# EasyEDA schematic 1-Schematic_andromeda.json

## Sheets
1 uC: TITLE: Sheet_1; REV: 1.0; Date: 2021-03-31; Sheet: 1/1; Drawn By: Łukasz Wojnarowski; Company: Your Company
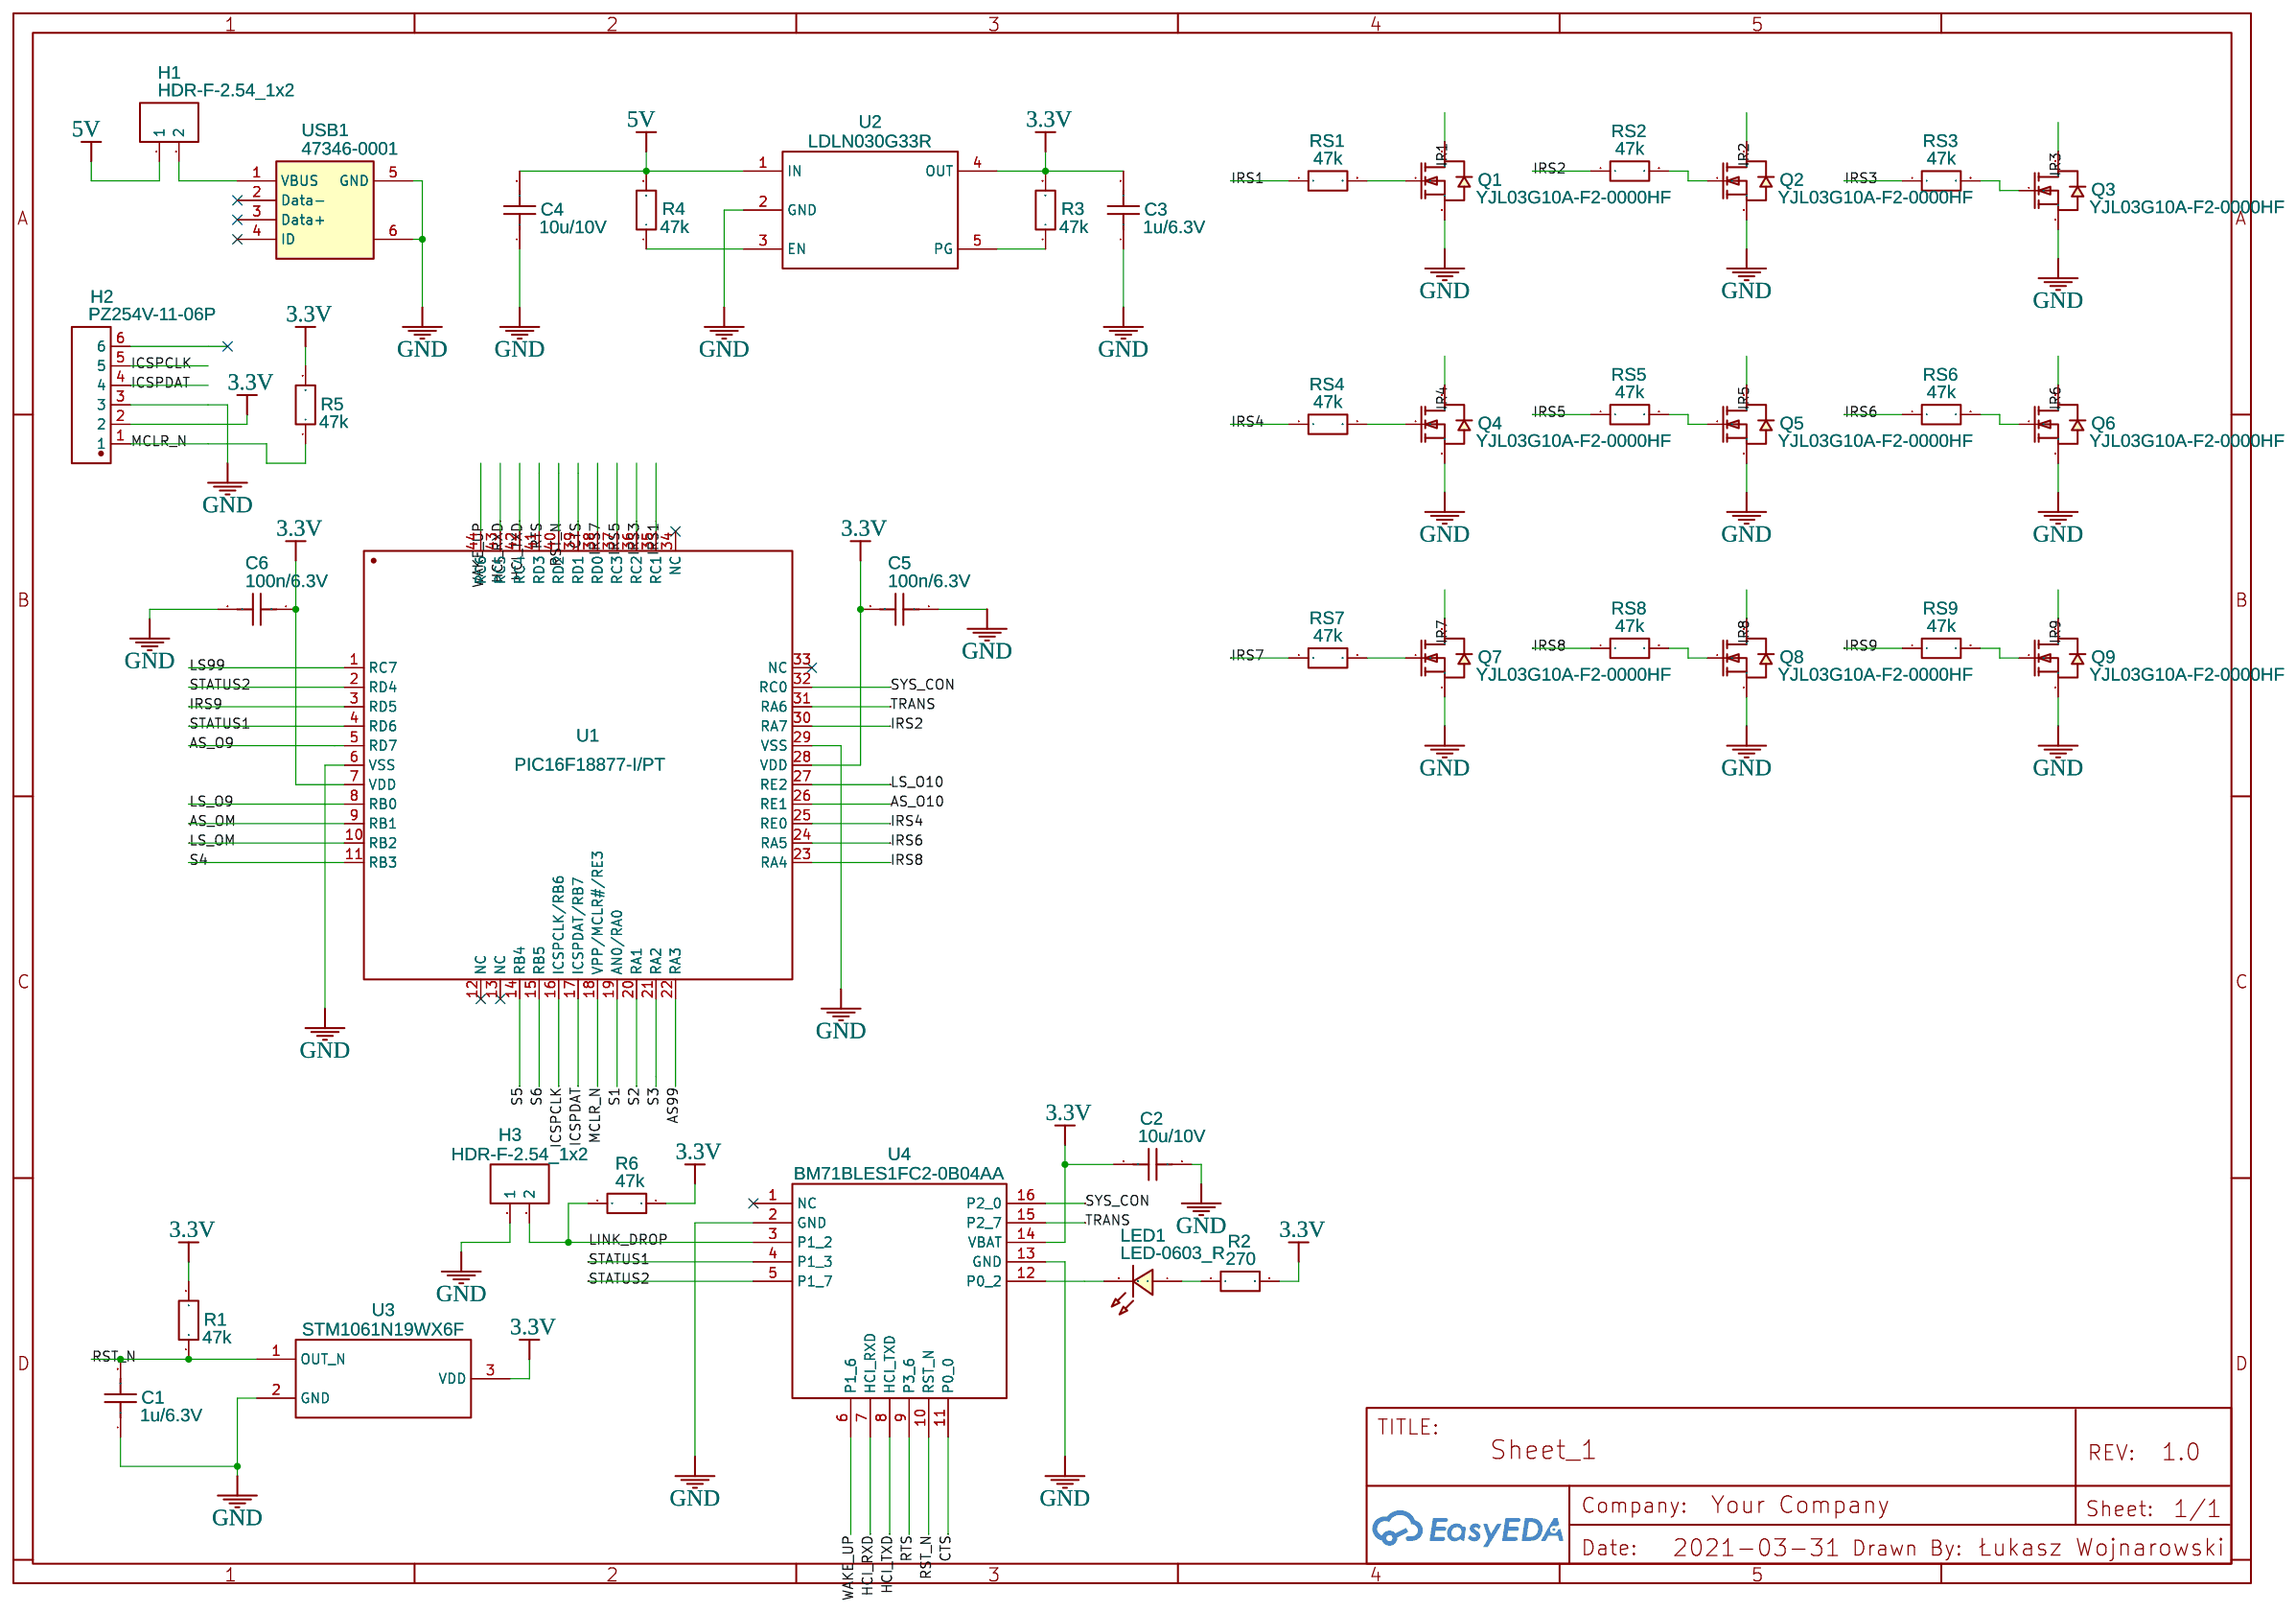
[diagram p0: uC]
2 MUX: TITLE: Sheet_2; Date: 2021-04-02; Drawn By: lukwojnar
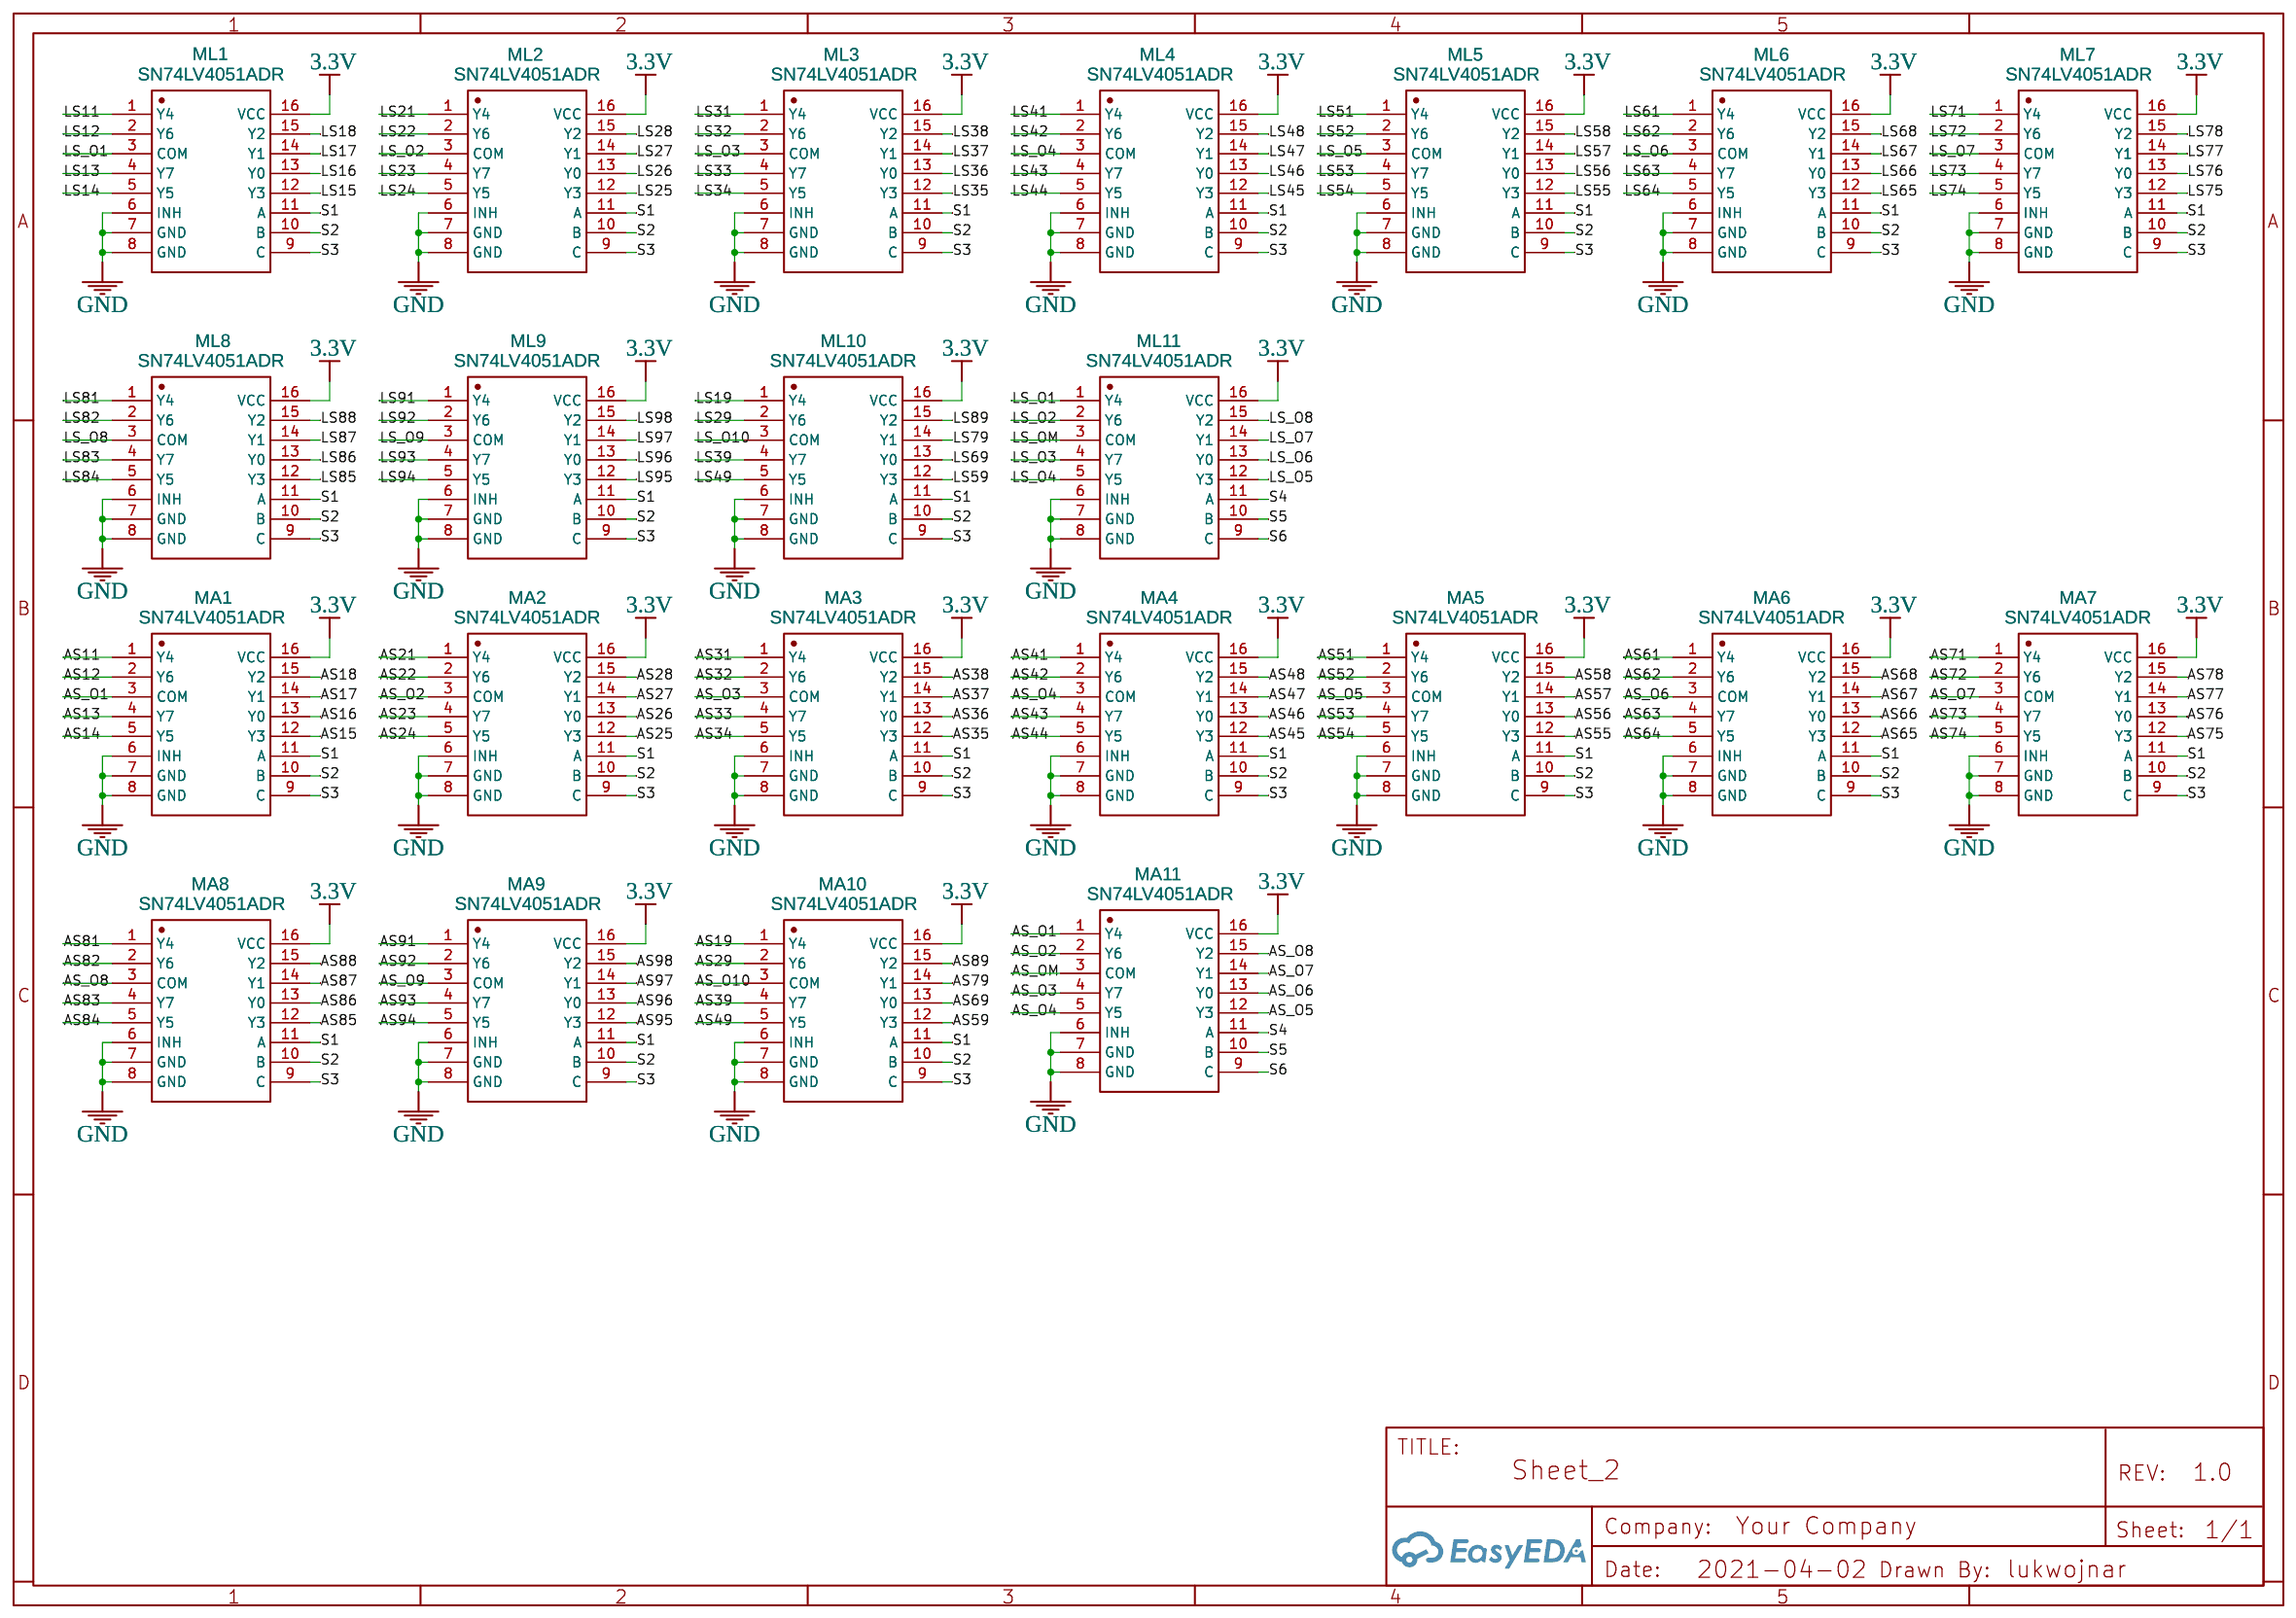
[diagram p1: MUX]
3 Light Sensors 1: Date: 2021-04-02
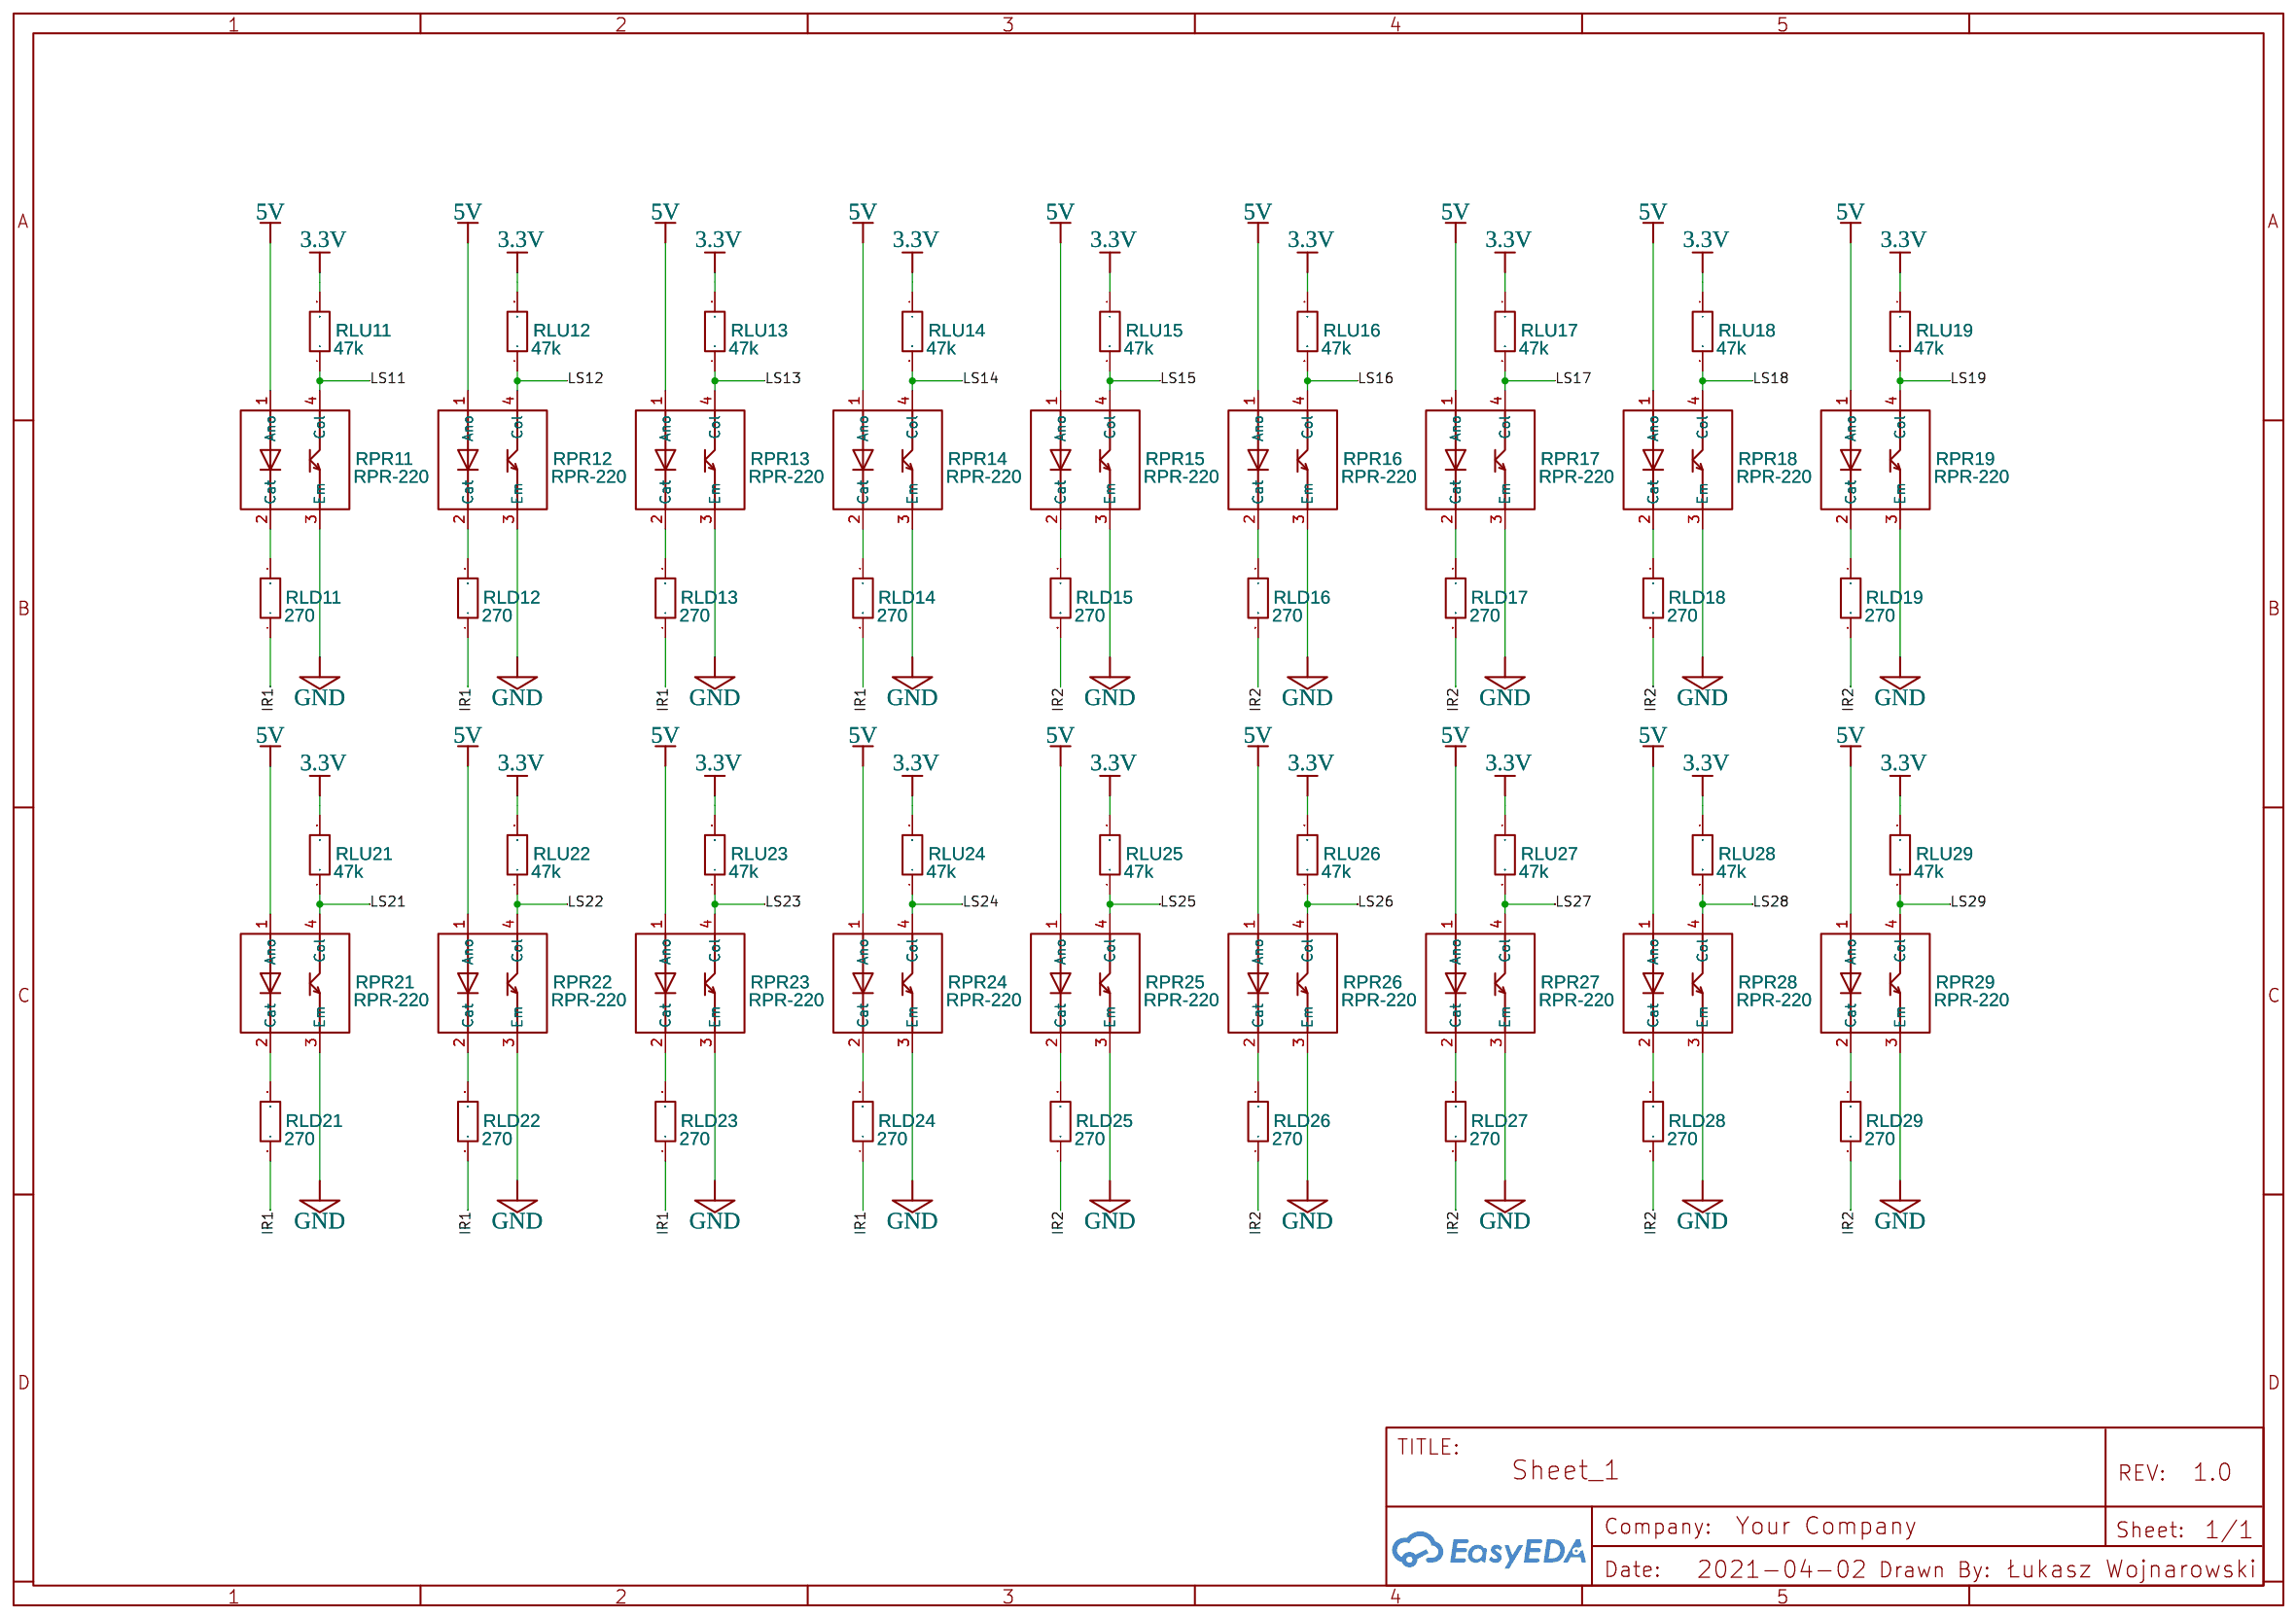
[diagram p2: Light Sensors 1]
4 Light Sensors 2: Date: 2021-04-03
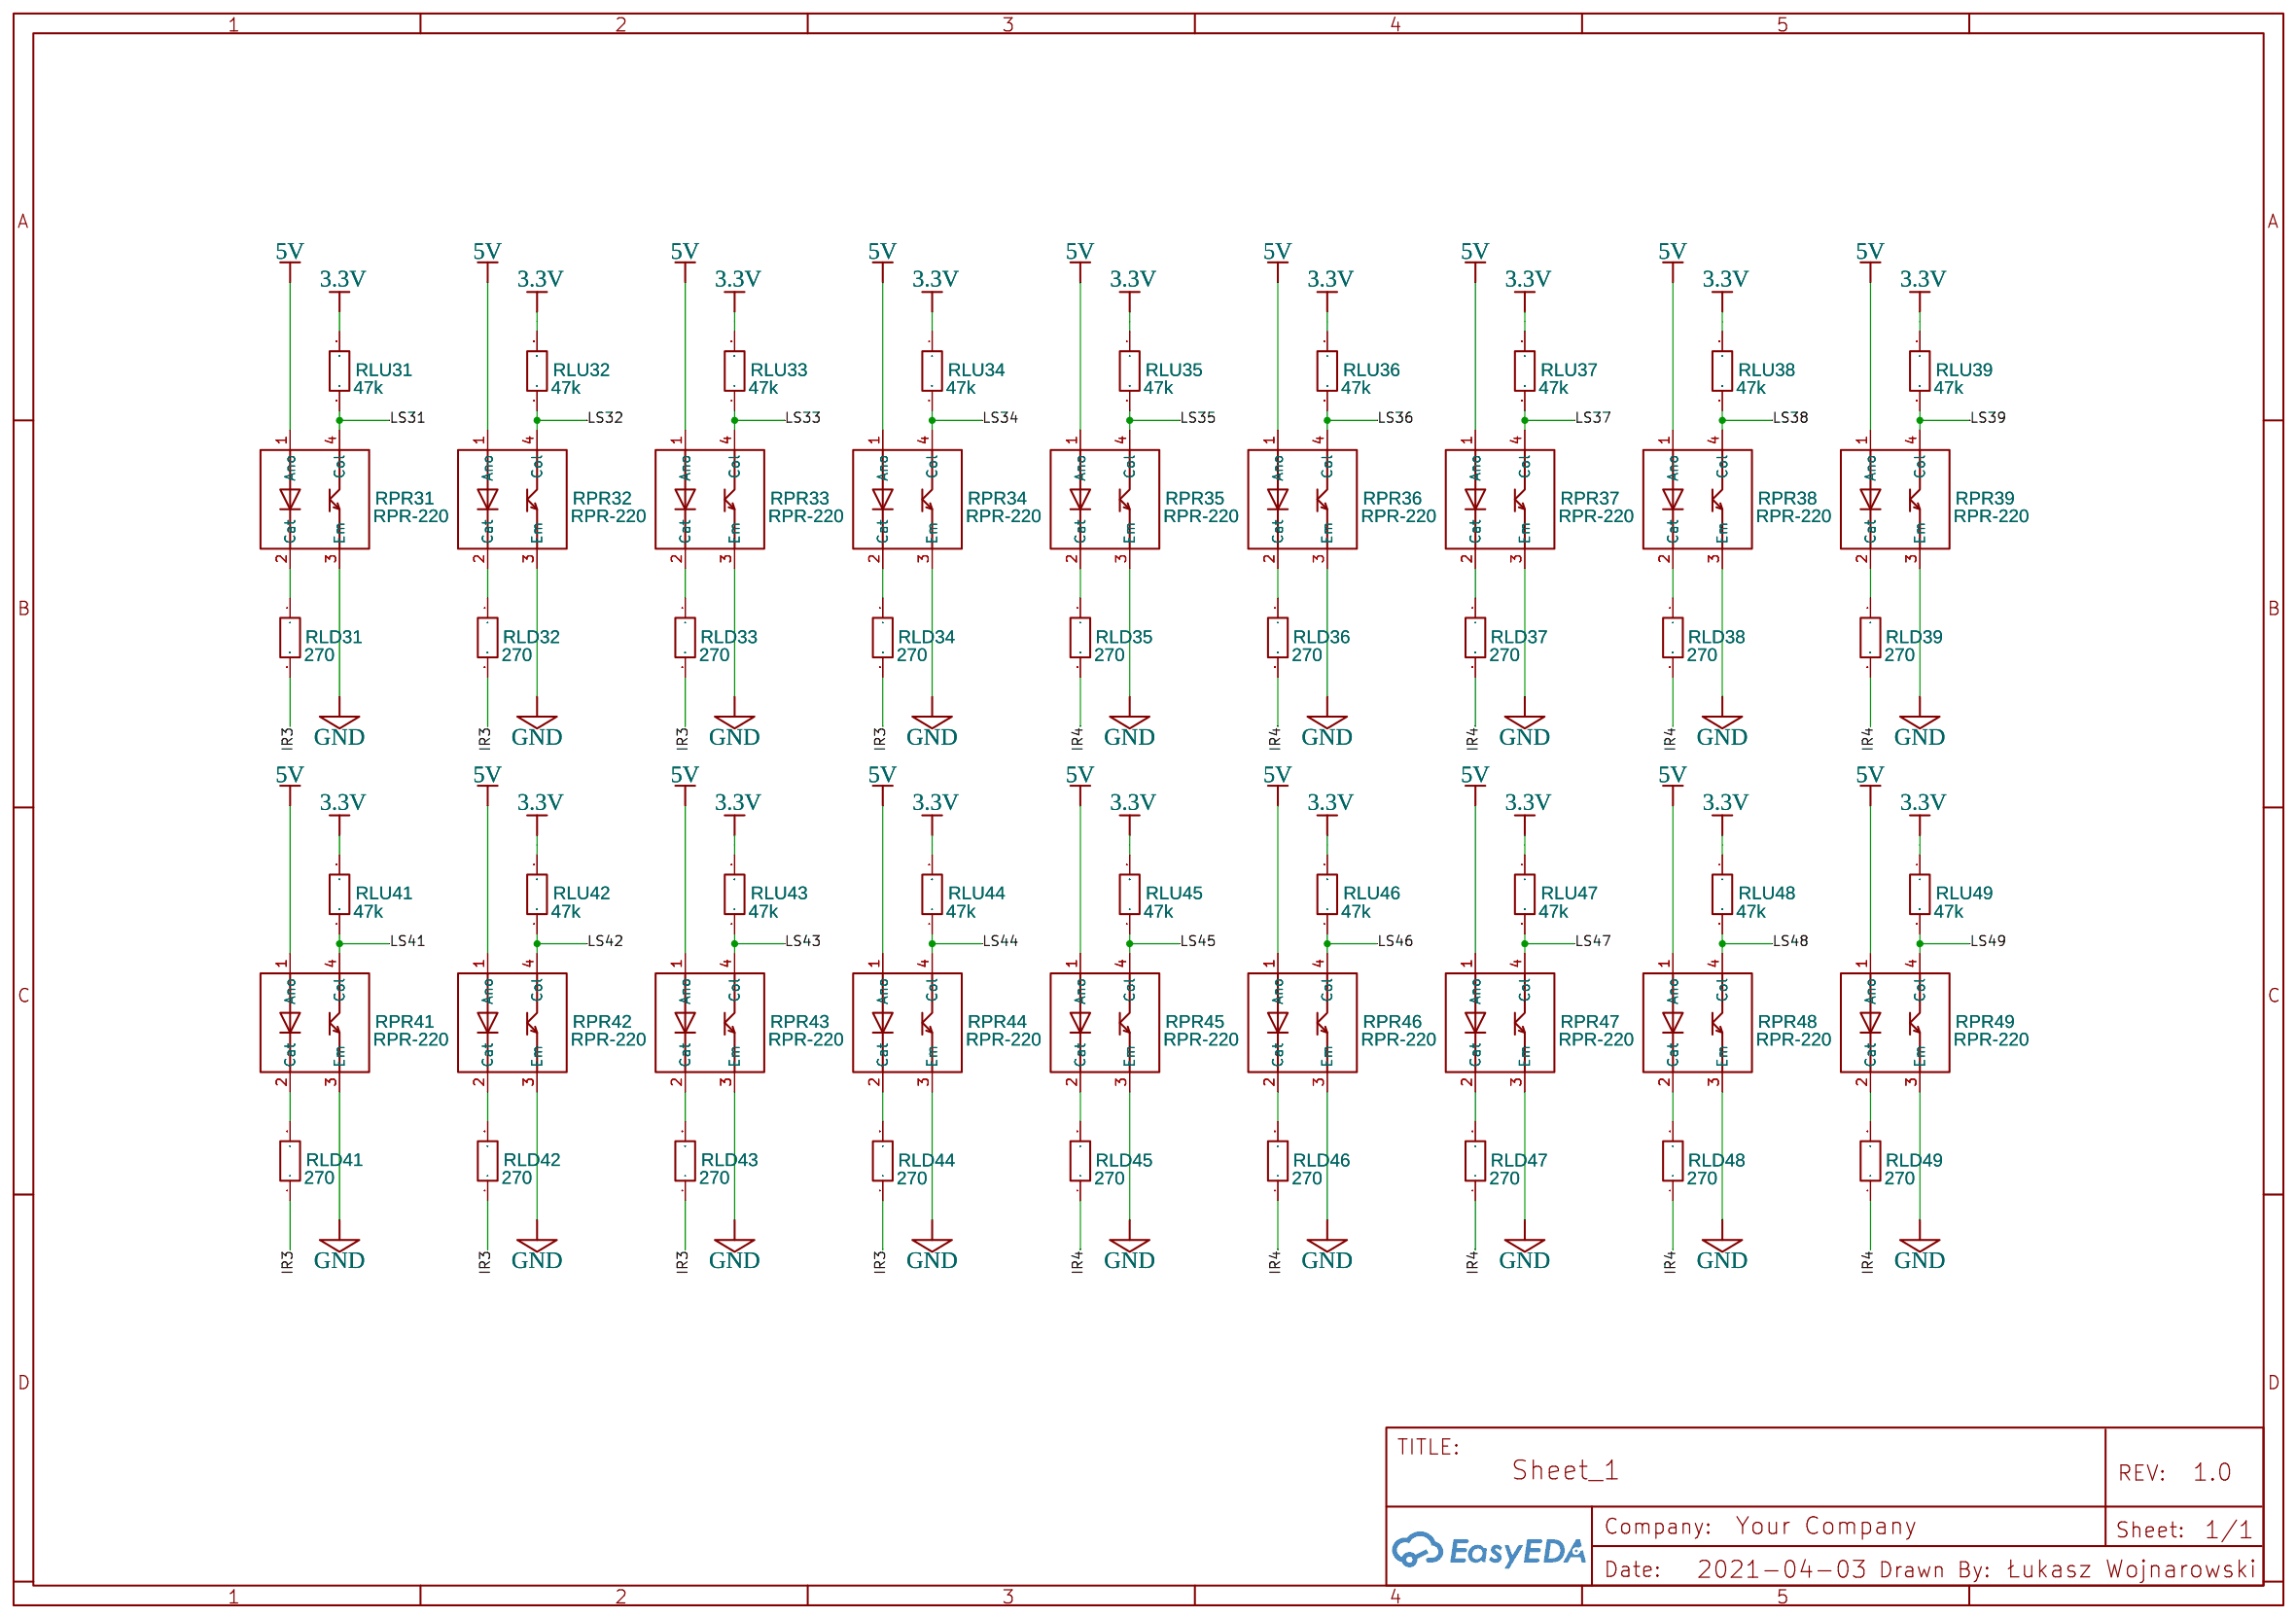
[diagram p3: Light Sensors 2]
5 Light Sensors 3: Date: 2021-04-03
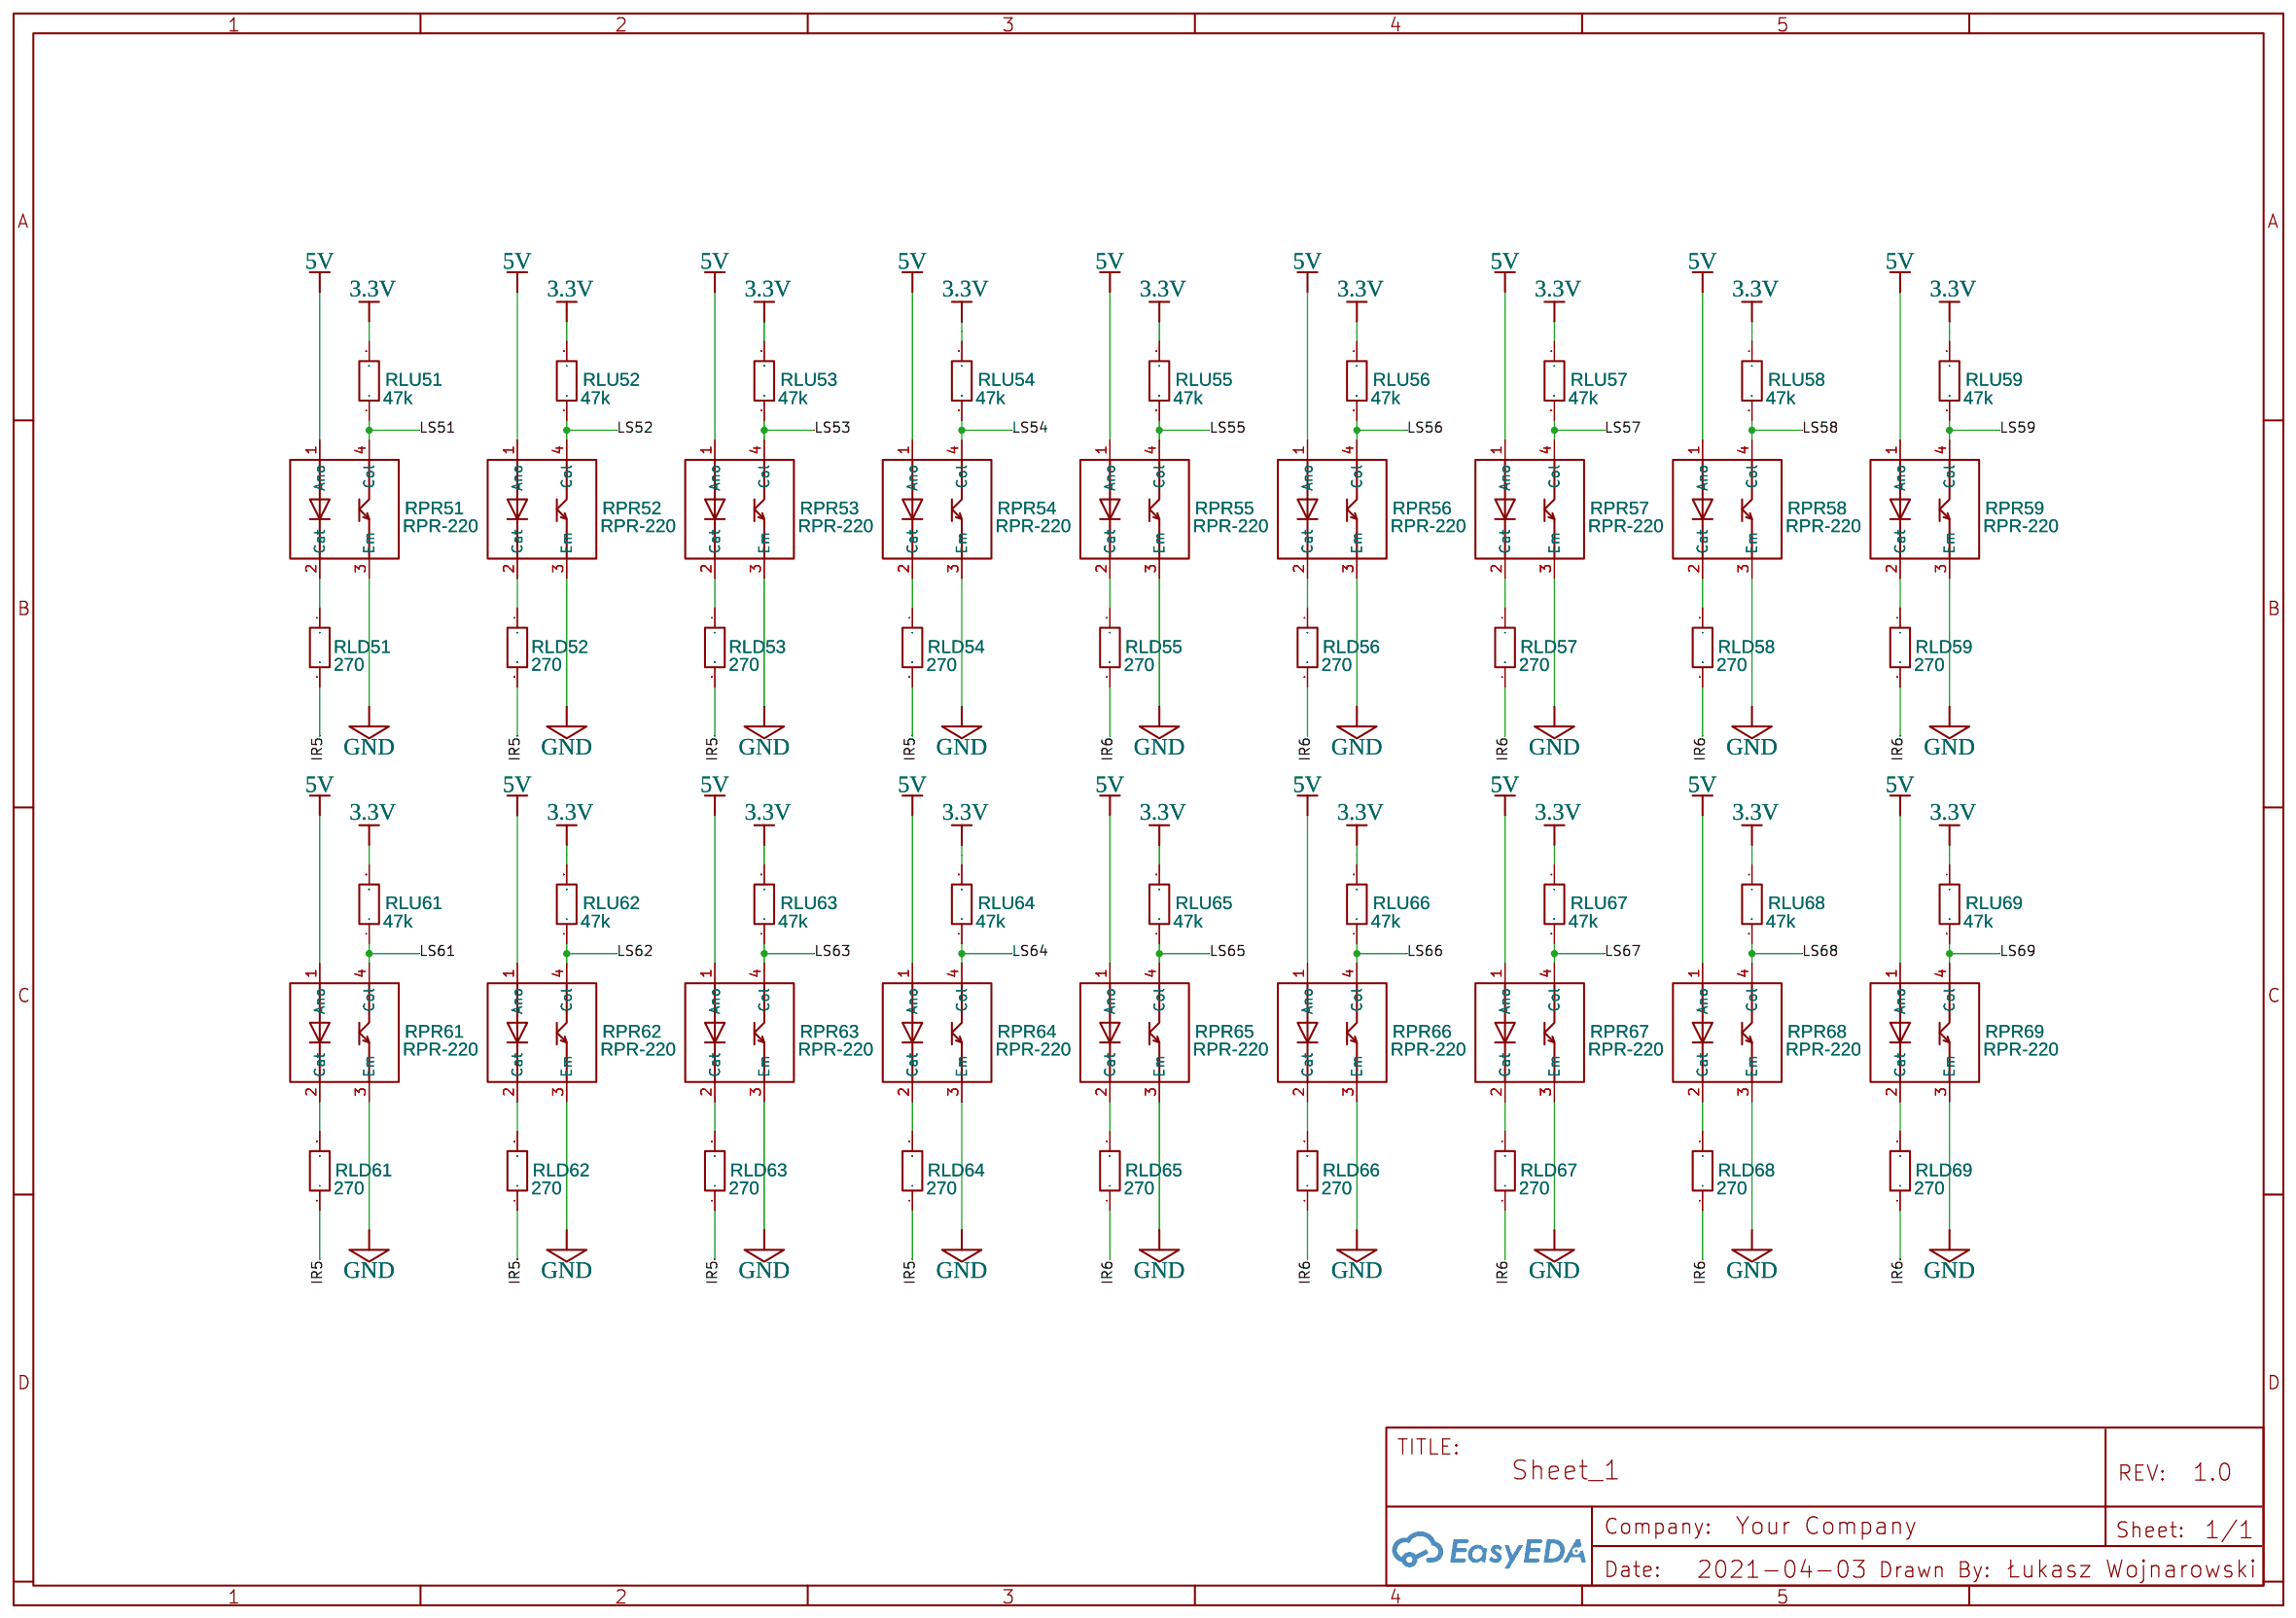
[diagram p4: Light Sensors 3]
6 Light Sensors 4: Date: 2021-04-03
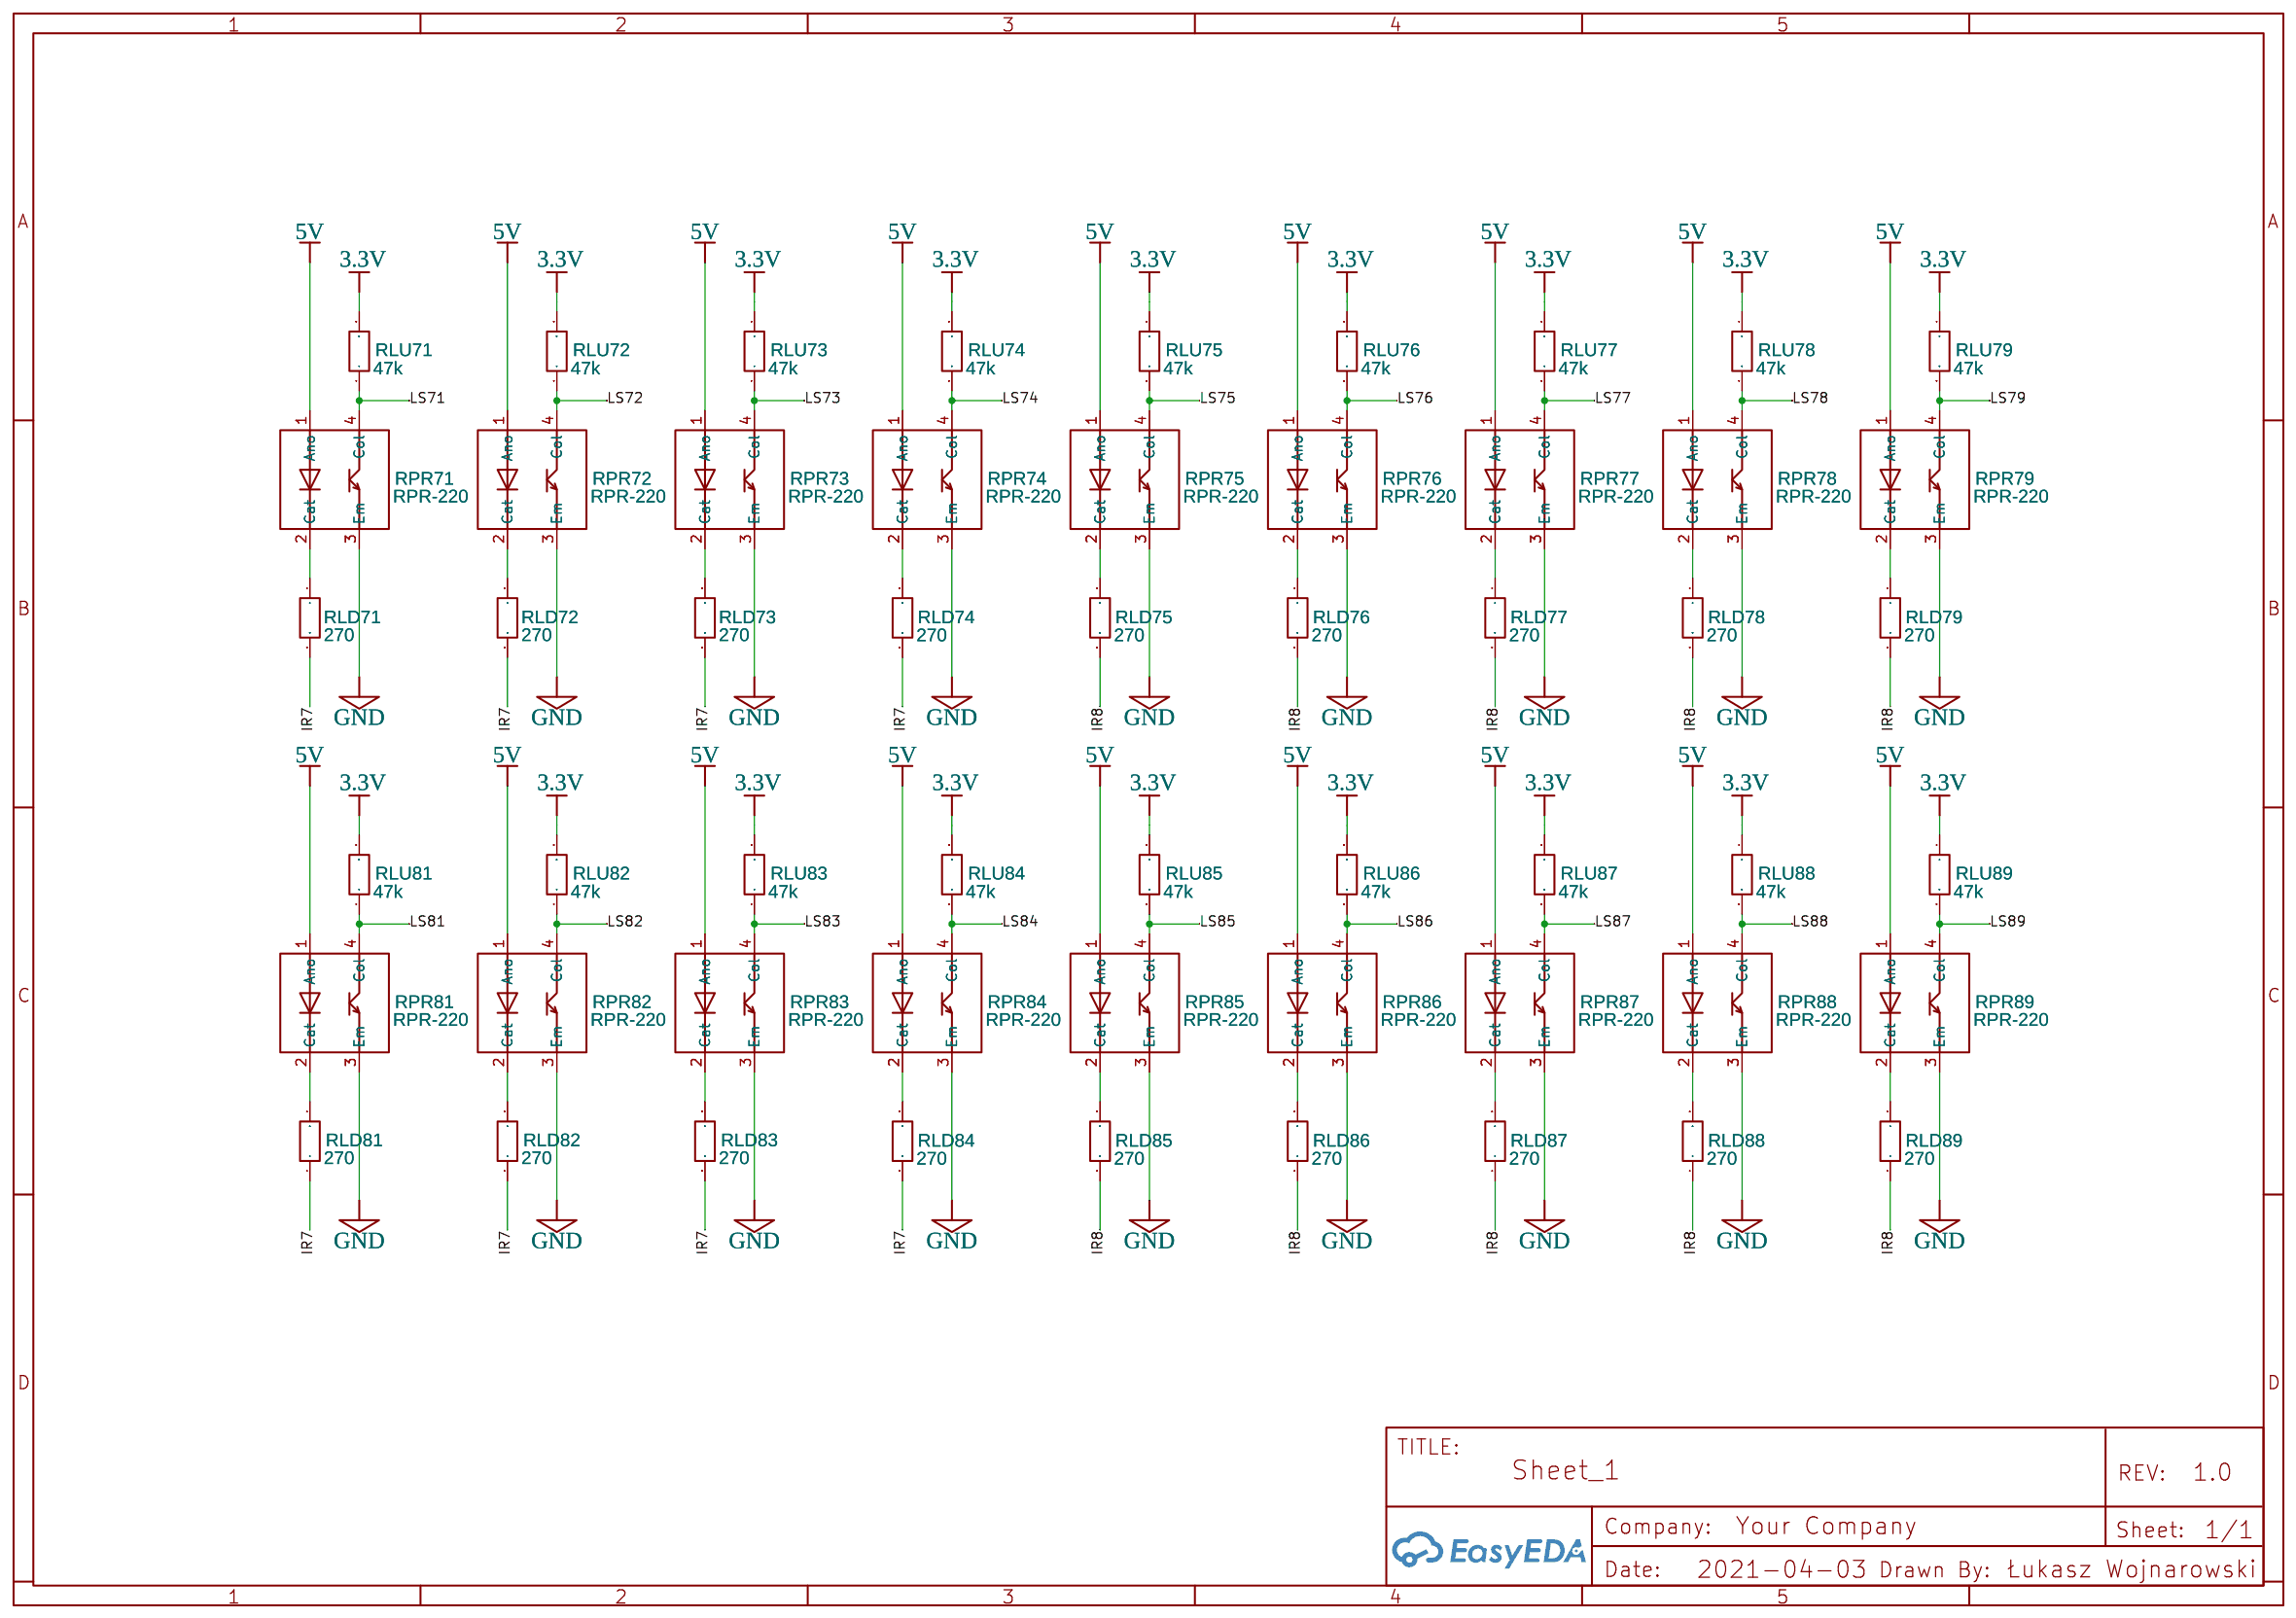
[diagram p5: Light Sensors 4]
7 Light Sensors 5: Date: 2021-04-03
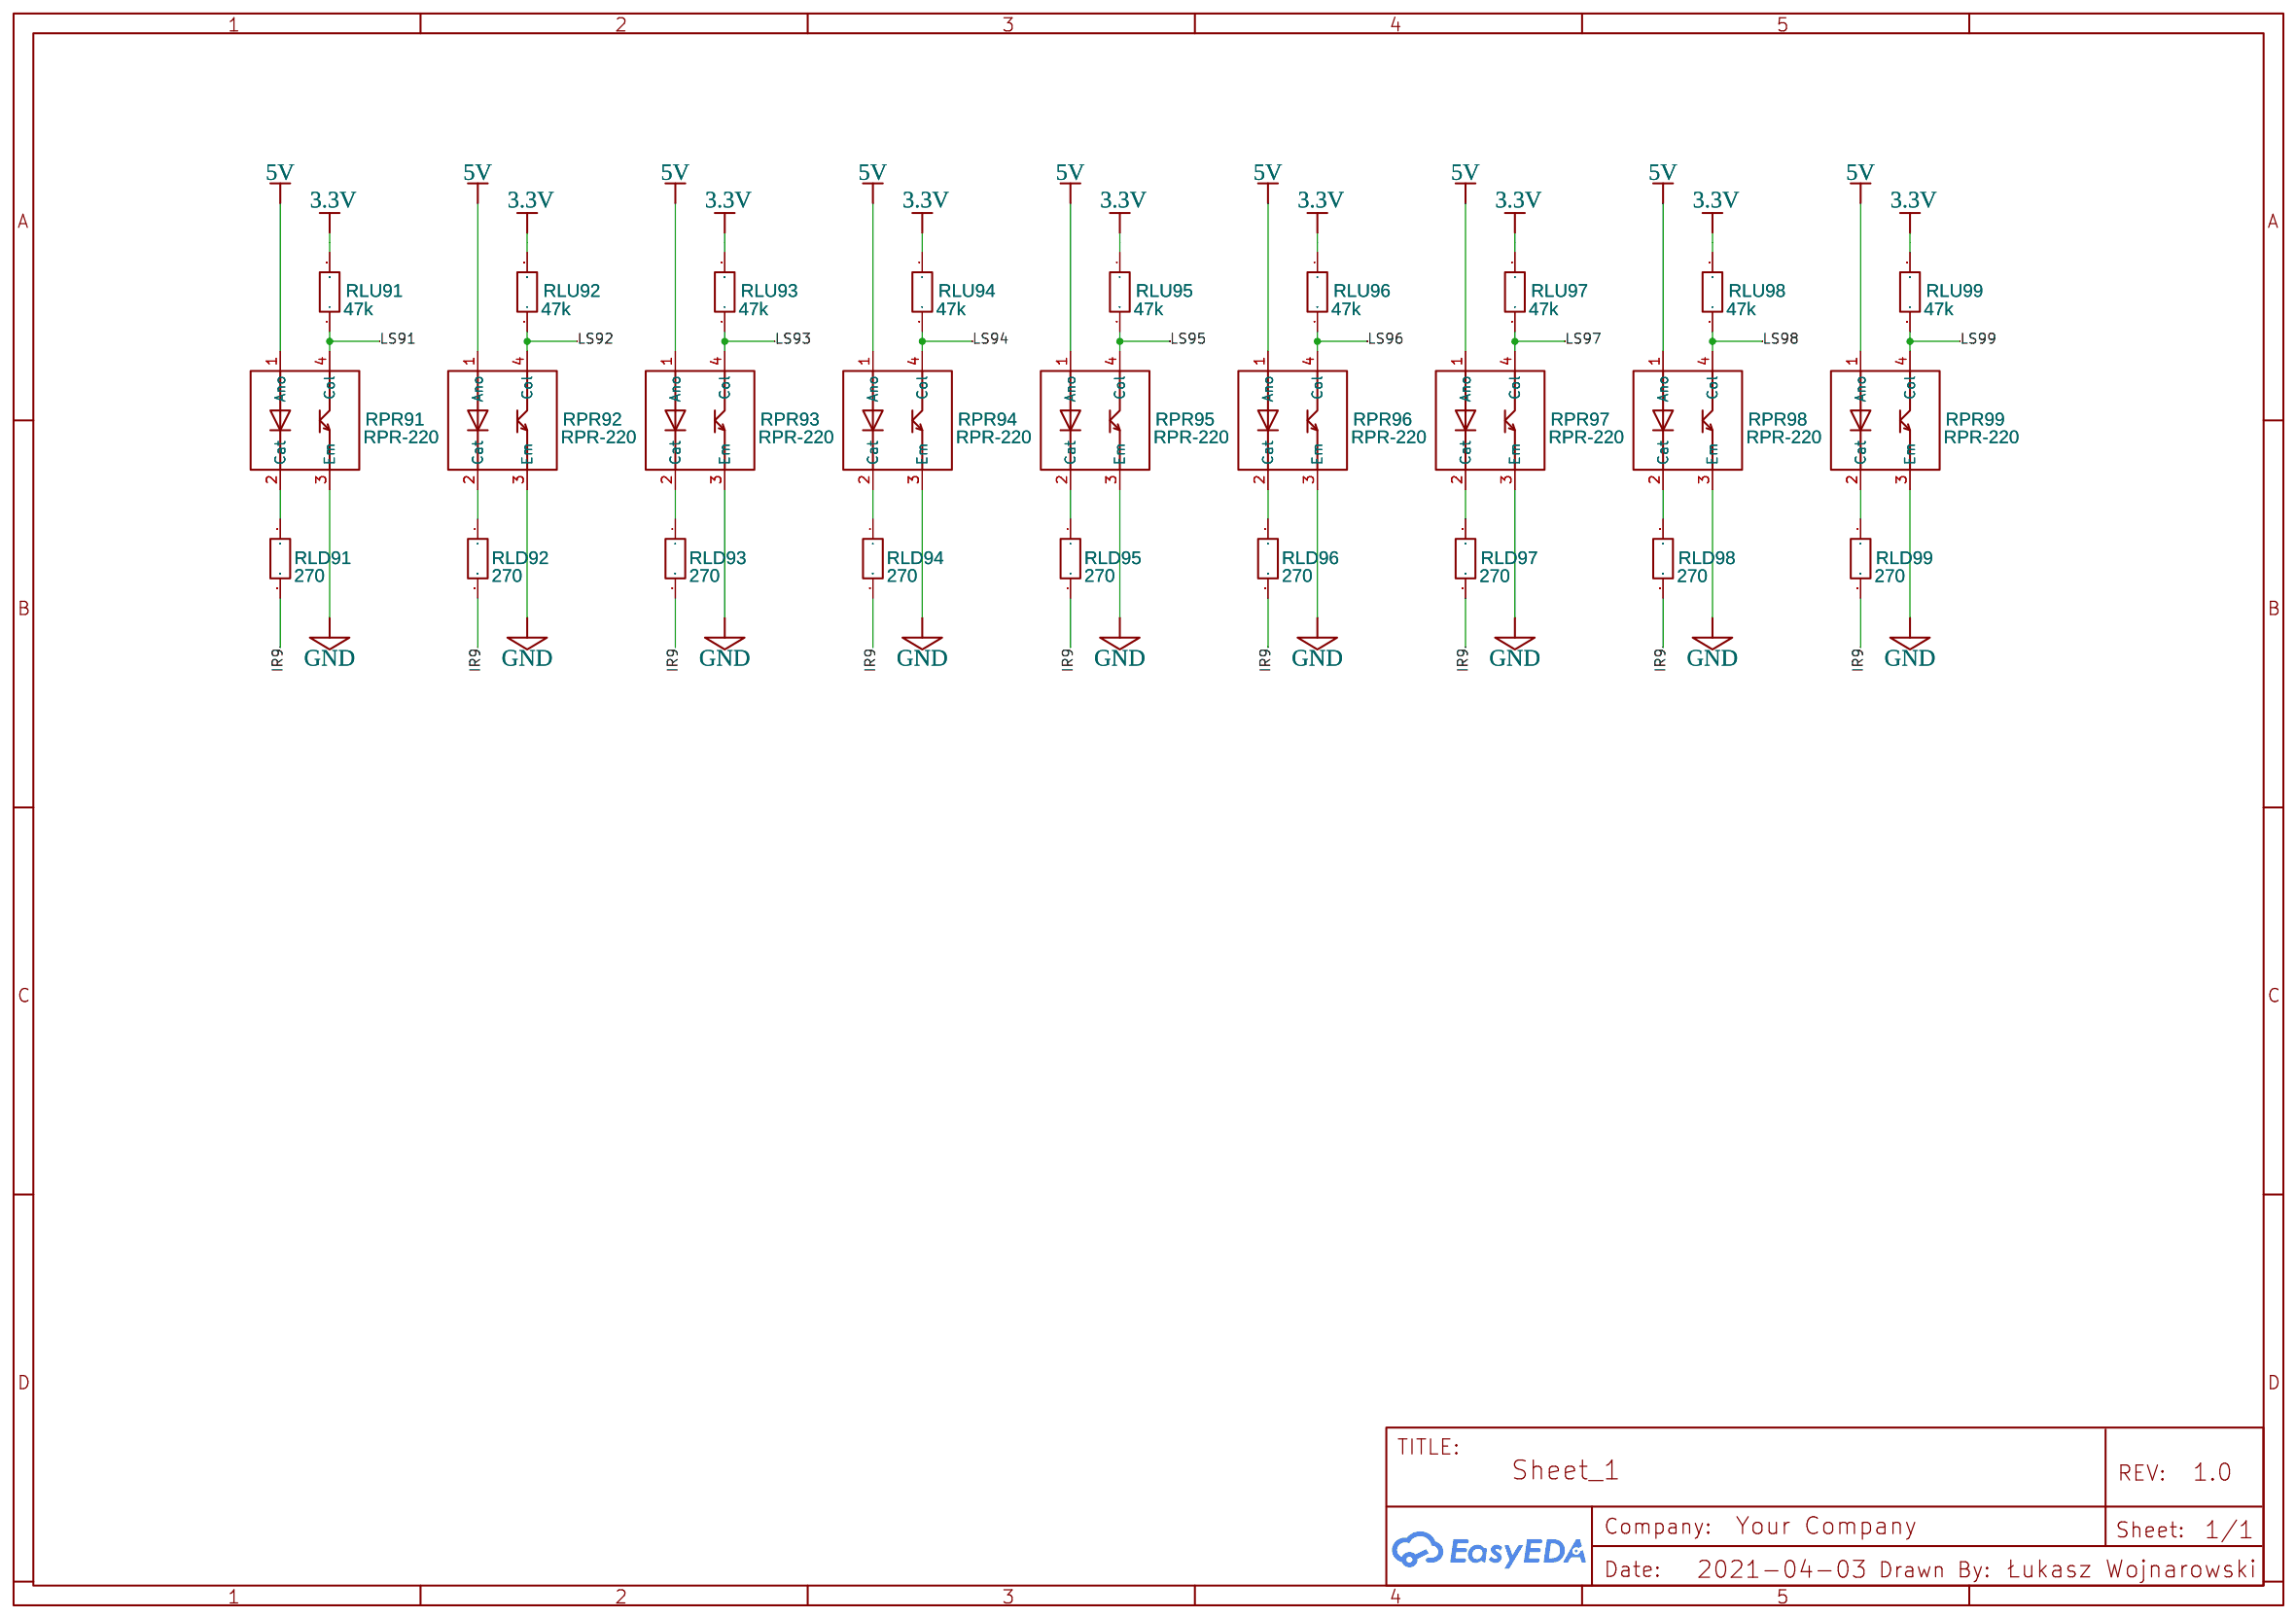
[diagram p6: Light Sensors 5]
8 Ambient Sensors 1: Date: 2021-04-03
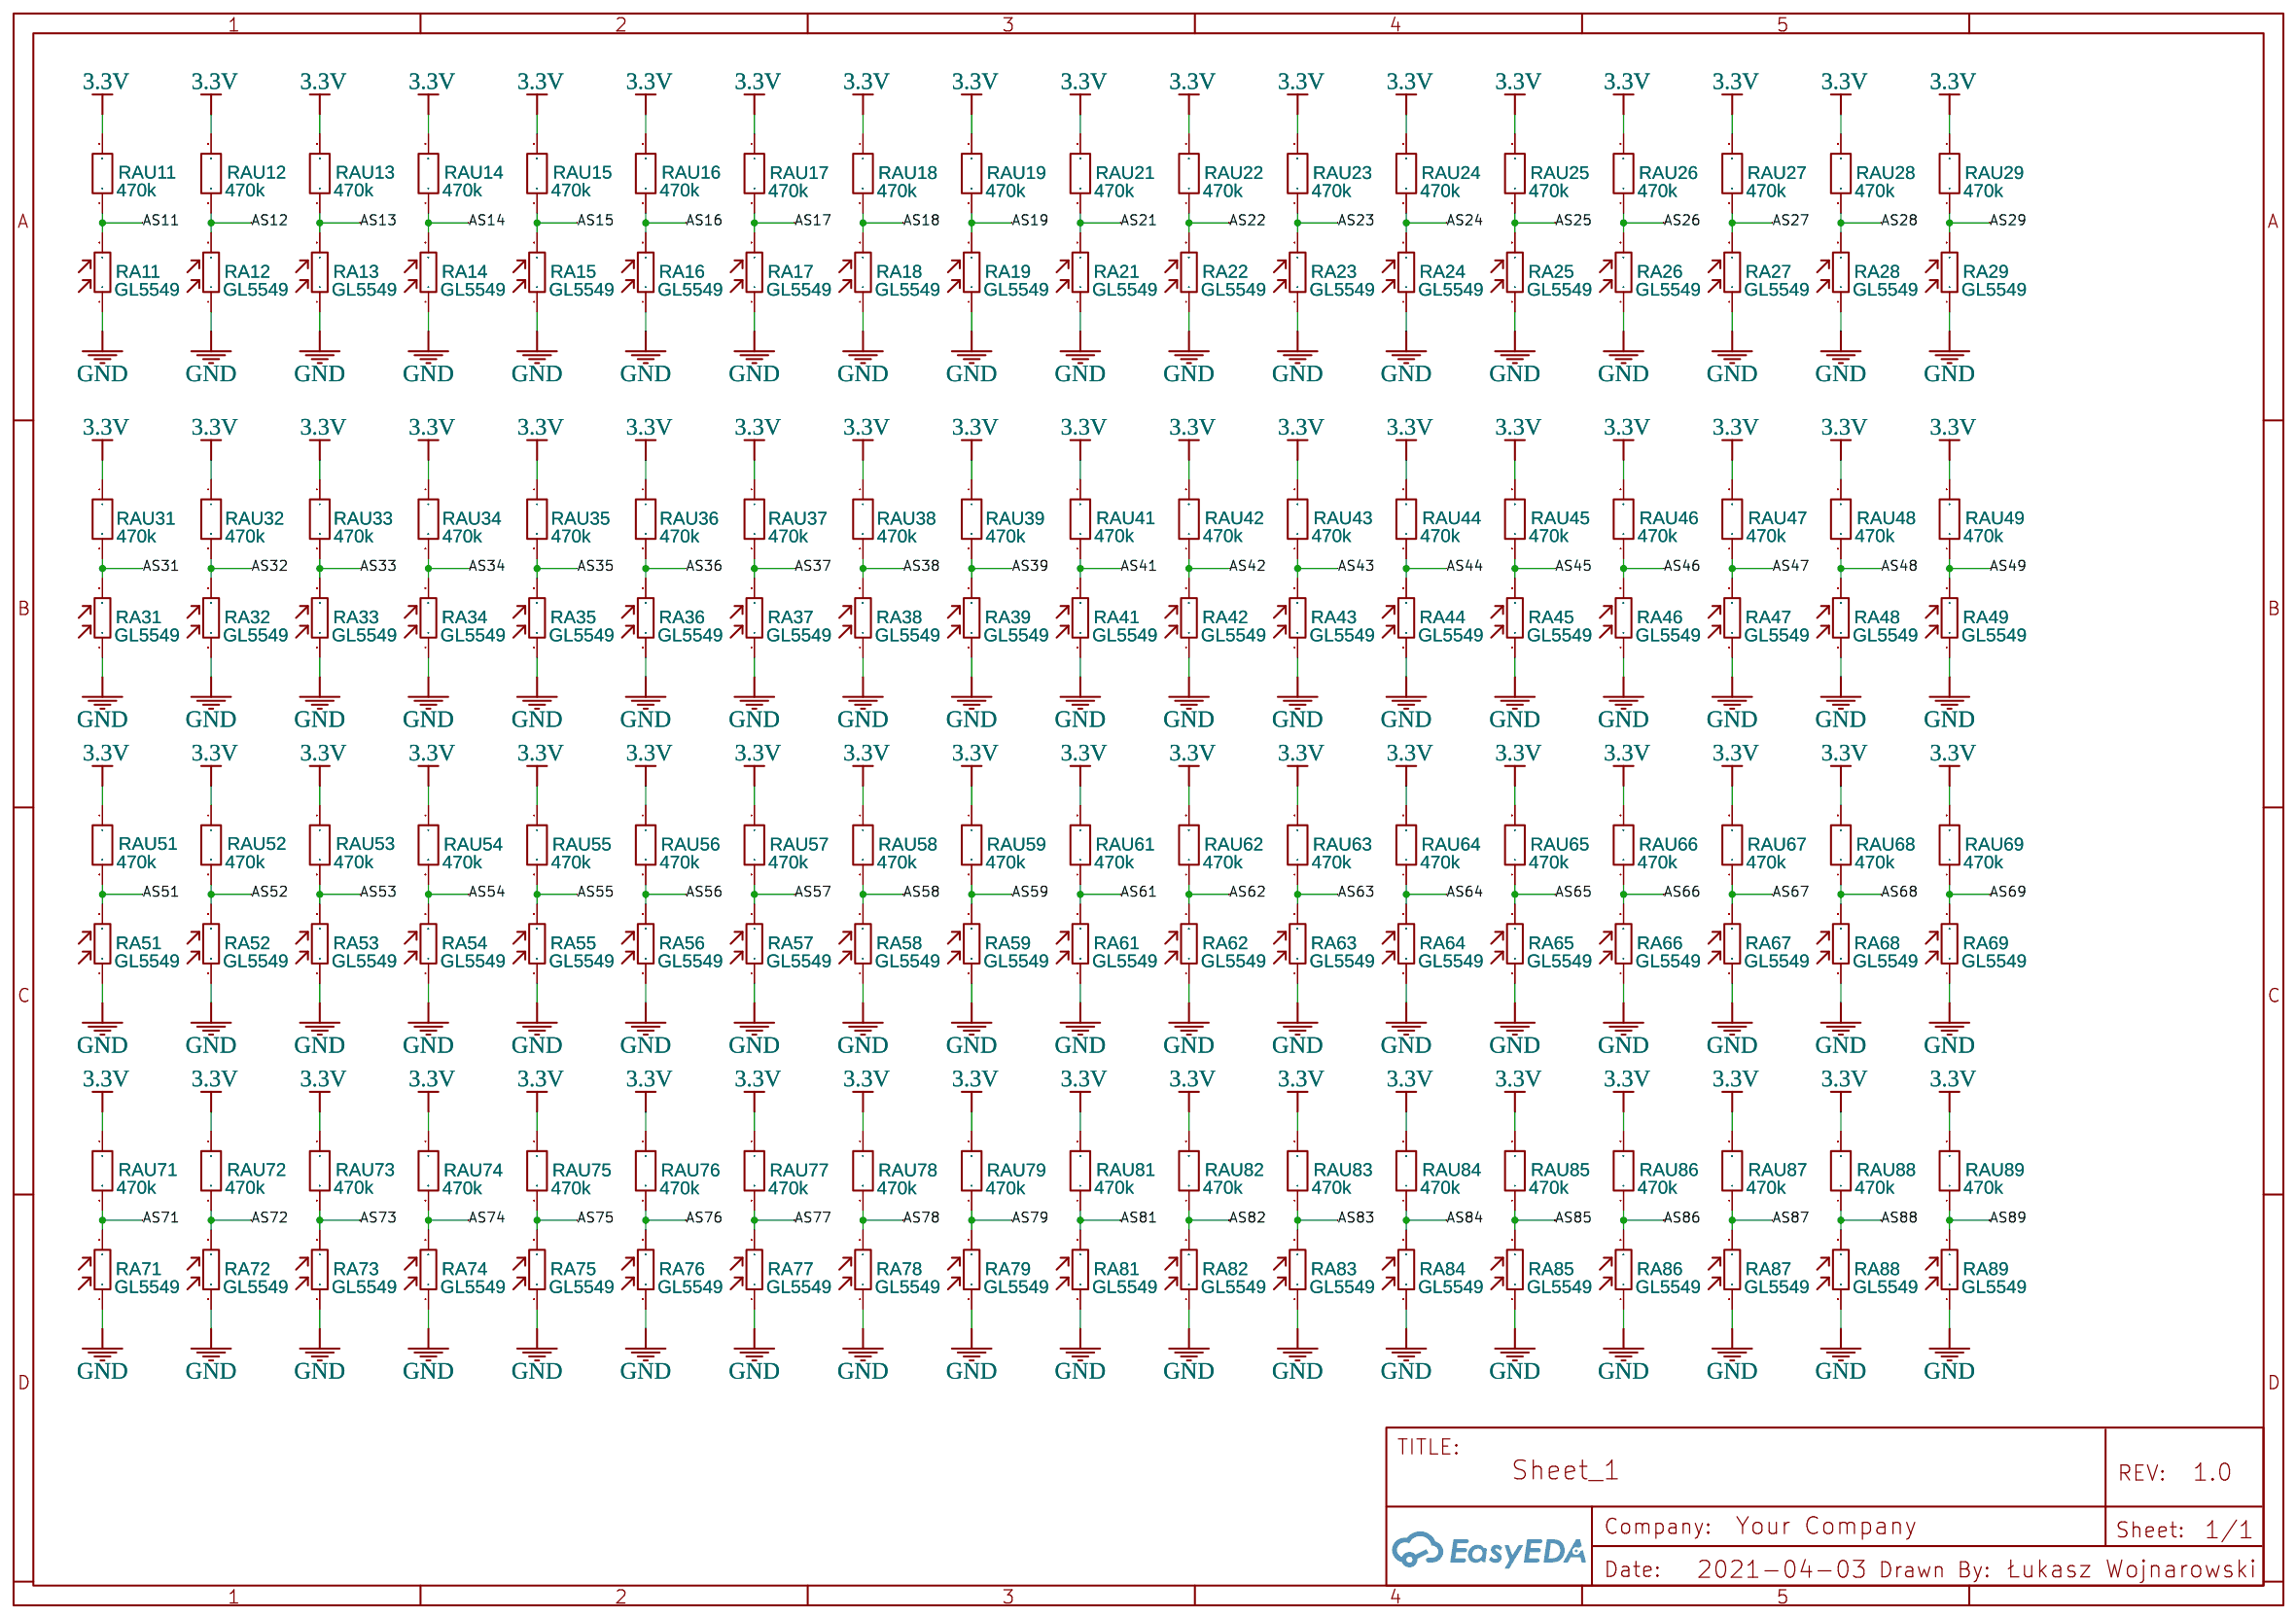
[diagram p7: Ambient Sensors 1]
9 Ambient Sensors 2: Date: 2021-04-03
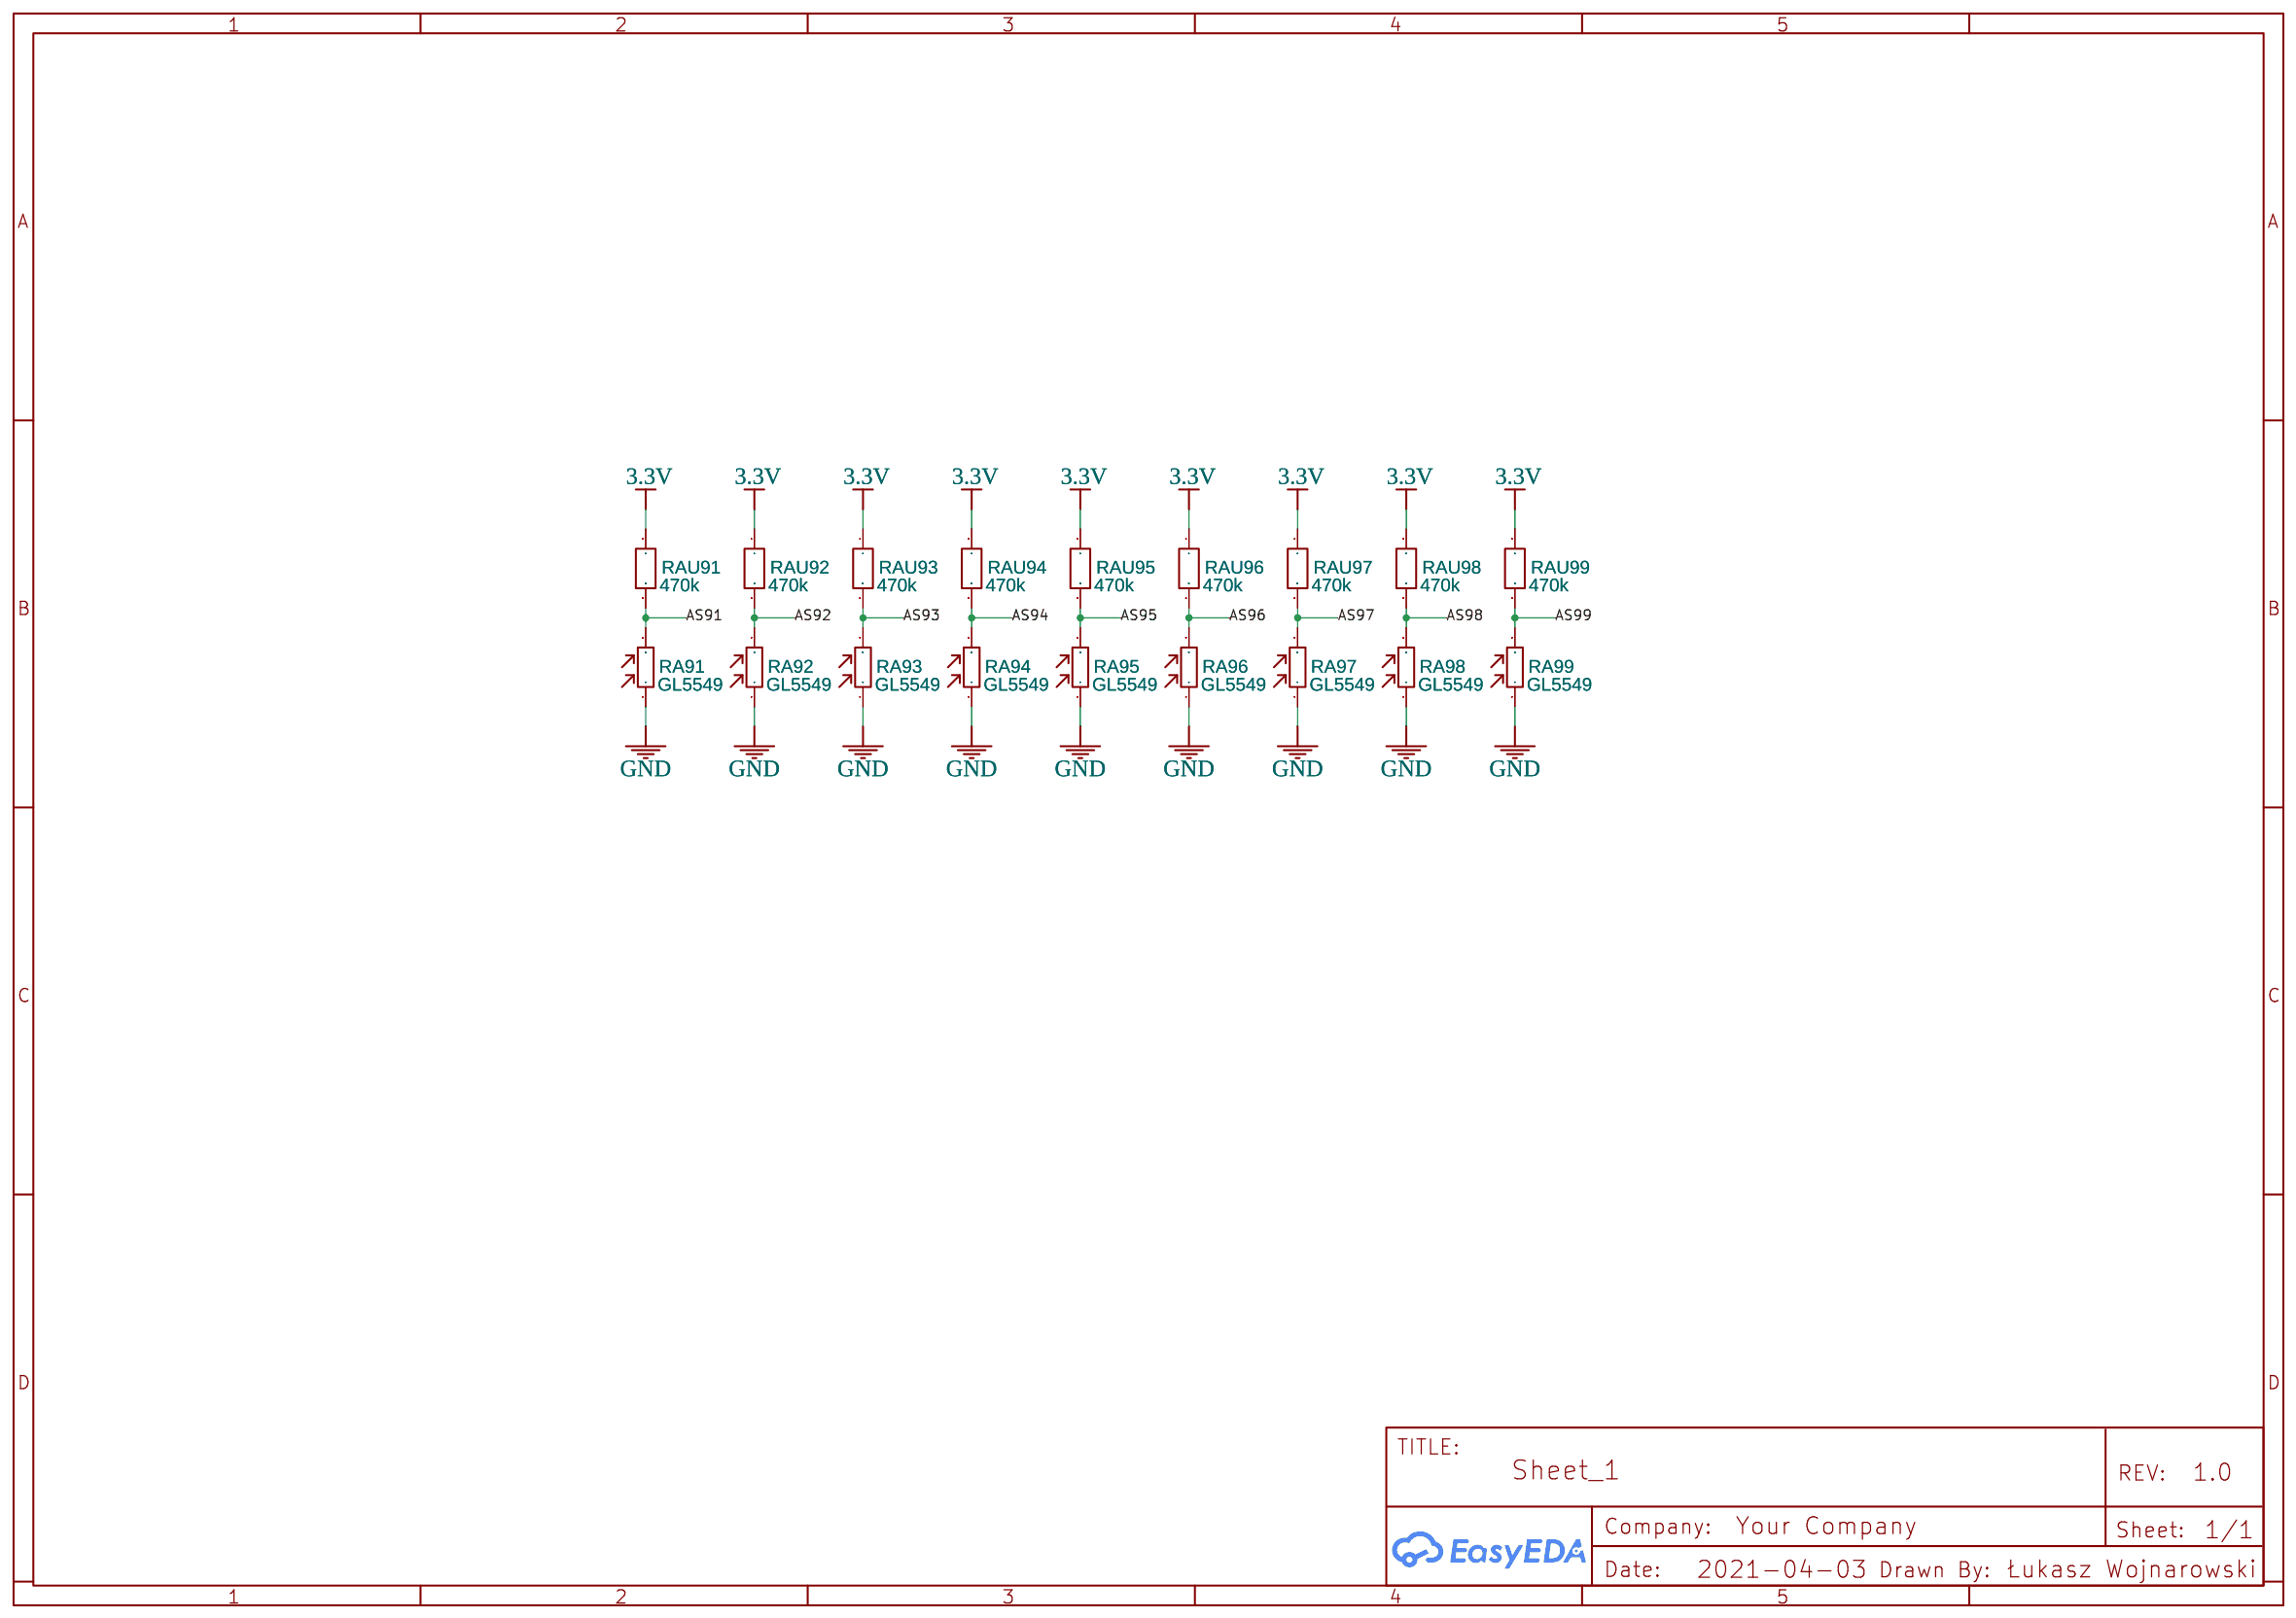
[diagram p8: Ambient Sensors 2]

## Parts
sheet Ambient Sensors 1
RA11  GL5549  [RES-TH_L5.1-W4.3-P3.40-D0.5]
RA12  GL5549  [RES-TH_L5.1-W4.3-P3.40-D0.5]
RA13  GL5549  [RES-TH_L5.1-W4.3-P3.40-D0.5]
RA14  GL5549  [RES-TH_L5.1-W4.3-P3.40-D0.5]
RA15  GL5549  [RES-TH_L5.1-W4.3-P3.40-D0.5]
RA16  GL5549  [RES-TH_L5.1-W4.3-P3.40-D0.5]
RA17  GL5549  [RES-TH_L5.1-W4.3-P3.40-D0.5]
RA18  GL5549  [RES-TH_L5.1-W4.3-P3.40-D0.5]
RA19  GL5549  [RES-TH_L5.1-W4.3-P3.40-D0.5]
RA21  GL5549  [RES-TH_L5.1-W4.3-P3.40-D0.5]
RA22  GL5549  [RES-TH_L5.1-W4.3-P3.40-D0.5]
RA23  GL5549  [RES-TH_L5.1-W4.3-P3.40-D0.5]
RA24  GL5549  [RES-TH_L5.1-W4.3-P3.40-D0.5]
RA25  GL5549  [RES-TH_L5.1-W4.3-P3.40-D0.5]
RA26  GL5549  [RES-TH_L5.1-W4.3-P3.40-D0.5]
RA27  GL5549  [RES-TH_L5.1-W4.3-P3.40-D0.5]
RA28  GL5549  [RES-TH_L5.1-W4.3-P3.40-D0.5]
RA29  GL5549  [RES-TH_L5.1-W4.3-P3.40-D0.5]
RA31  GL5549  [RES-TH_L5.1-W4.3-P3.40-D0.5]
RA32  GL5549  [RES-TH_L5.1-W4.3-P3.40-D0.5]
RA33  GL5549  [RES-TH_L5.1-W4.3-P3.40-D0.5]
RA34  GL5549  [RES-TH_L5.1-W4.3-P3.40-D0.5]
RA35  GL5549  [RES-TH_L5.1-W4.3-P3.40-D0.5]
RA36  GL5549  [RES-TH_L5.1-W4.3-P3.40-D0.5]
RA37  GL5549  [RES-TH_L5.1-W4.3-P3.40-D0.5]
RA38  GL5549  [RES-TH_L5.1-W4.3-P3.40-D0.5]
RA39  GL5549  [RES-TH_L5.1-W4.3-P3.40-D0.5]
RA41  GL5549  [RES-TH_L5.1-W4.3-P3.40-D0.5]
RA42  GL5549  [RES-TH_L5.1-W4.3-P3.40-D0.5]
RA43  GL5549  [RES-TH_L5.1-W4.3-P3.40-D0.5]
RA44  GL5549  [RES-TH_L5.1-W4.3-P3.40-D0.5]
RA45  GL5549  [RES-TH_L5.1-W4.3-P3.40-D0.5]
RA46  GL5549  [RES-TH_L5.1-W4.3-P3.40-D0.5]
RA47  GL5549  [RES-TH_L5.1-W4.3-P3.40-D0.5]
RA48  GL5549  [RES-TH_L5.1-W4.3-P3.40-D0.5]
RA49  GL5549  [RES-TH_L5.1-W4.3-P3.40-D0.5]
RA51  GL5549  [RES-TH_L5.1-W4.3-P3.40-D0.5]
RA52  GL5549  [RES-TH_L5.1-W4.3-P3.40-D0.5]
RA53  GL5549  [RES-TH_L5.1-W4.3-P3.40-D0.5]
RA54  GL5549  [RES-TH_L5.1-W4.3-P3.40-D0.5]
RA55  GL5549  [RES-TH_L5.1-W4.3-P3.40-D0.5]
RA56  GL5549  [RES-TH_L5.1-W4.3-P3.40-D0.5]
RA57  GL5549  [RES-TH_L5.1-W4.3-P3.40-D0.5]
RA58  GL5549  [RES-TH_L5.1-W4.3-P3.40-D0.5]
RA59  GL5549  [RES-TH_L5.1-W4.3-P3.40-D0.5]
RA61  GL5549  [RES-TH_L5.1-W4.3-P3.40-D0.5]
RA62  GL5549  [RES-TH_L5.1-W4.3-P3.40-D0.5]
RA63  GL5549  [RES-TH_L5.1-W4.3-P3.40-D0.5]
RA64  GL5549  [RES-TH_L5.1-W4.3-P3.40-D0.5]
RA65  GL5549  [RES-TH_L5.1-W4.3-P3.40-D0.5]
RA66  GL5549  [RES-TH_L5.1-W4.3-P3.40-D0.5]
RA67  GL5549  [RES-TH_L5.1-W4.3-P3.40-D0.5]
RA68  GL5549  [RES-TH_L5.1-W4.3-P3.40-D0.5]
RA69  GL5549  [RES-TH_L5.1-W4.3-P3.40-D0.5]
RA71  GL5549  [RES-TH_L5.1-W4.3-P3.40-D0.5]
RA72  GL5549  [RES-TH_L5.1-W4.3-P3.40-D0.5]
RA73  GL5549  [RES-TH_L5.1-W4.3-P3.40-D0.5]
RA74  GL5549  [RES-TH_L5.1-W4.3-P3.40-D0.5]
RA75  GL5549  [RES-TH_L5.1-W4.3-P3.40-D0.5]
RA76  GL5549  [RES-TH_L5.1-W4.3-P3.40-D0.5]
RA77  GL5549  [RES-TH_L5.1-W4.3-P3.40-D0.5]
RA78  GL5549  [RES-TH_L5.1-W4.3-P3.40-D0.5]
RA79  GL5549  [RES-TH_L5.1-W4.3-P3.40-D0.5]
RA81  GL5549  [RES-TH_L5.1-W4.3-P3.40-D0.5]
RA82  GL5549  [RES-TH_L5.1-W4.3-P3.40-D0.5]
RA83  GL5549  [RES-TH_L5.1-W4.3-P3.40-D0.5]
RA84  GL5549  [RES-TH_L5.1-W4.3-P3.40-D0.5]
RA85  GL5549  [RES-TH_L5.1-W4.3-P3.40-D0.5]
RA86  GL5549  [RES-TH_L5.1-W4.3-P3.40-D0.5]
RA87  GL5549  [RES-TH_L5.1-W4.3-P3.40-D0.5]
RA88  GL5549  [RES-TH_L5.1-W4.3-P3.40-D0.5]
RA89  GL5549  [RES-TH_L5.1-W4.3-P3.40-D0.5]
RAU11  470k  [R0603]
RAU12  470k  [R0603]
RAU13  470k  [R0603]
RAU14  470k  [R0603]
RAU15  470k  [R0603]
RAU16  470k  [R0603]
RAU17  470k  [R0603]
RAU18  470k  [R0603]
RAU19  470k  [R0603]
RAU21  470k  [R0603]
RAU22  470k  [R0603]
RAU23  470k  [R0603]
RAU24  470k  [R0603]
RAU25  470k  [R0603]
RAU26  470k  [R0603]
RAU27  470k  [R0603]
RAU28  470k  [R0603]
RAU29  470k  [R0603]
RAU31  470k  [R0603]
RAU32  470k  [R0603]
RAU33  470k  [R0603]
RAU34  470k  [R0603]
RAU35  470k  [R0603]
RAU36  470k  [R0603]
RAU37  470k  [R0603]
RAU38  470k  [R0603]
RAU39  470k  [R0603]
RAU41  470k  [R0603]
RAU42  470k  [R0603]
RAU43  470k  [R0603]
RAU44  470k  [R0603]
RAU45  470k  [R0603]
RAU46  470k  [R0603]
RAU47  470k  [R0603]
RAU48  470k  [R0603]
RAU49  470k  [R0603]
RAU51  470k  [R0603]
RAU52  470k  [R0603]
RAU53  470k  [R0603]
RAU54  470k  [R0603]
RAU55  470k  [R0603]
RAU56  470k  [R0603]
RAU57  470k  [R0603]
RAU58  470k  [R0603]
RAU59  470k  [R0603]
RAU61  470k  [R0603]
RAU62  470k  [R0603]
RAU63  470k  [R0603]
RAU64  470k  [R0603]
RAU65  470k  [R0603]
RAU66  470k  [R0603]
RAU67  470k  [R0603]
RAU68  470k  [R0603]
RAU69  470k  [R0603]
RAU71  470k  [R0603]
RAU72  470k  [R0603]
RAU73  470k  [R0603]
RAU74  470k  [R0603]
RAU75  470k  [R0603]
RAU76  470k  [R0603]
RAU77  470k  [R0603]
RAU78  470k  [R0603]
RAU79  470k  [R0603]
RAU81  470k  [R0603]
RAU82  470k  [R0603]
RAU83  470k  [R0603]
RAU84  470k  [R0603]
RAU85  470k  [R0603]
RAU86  470k  [R0603]
RAU87  470k  [R0603]
RAU88  470k  [R0603]
RAU89  470k  [R0603]
sheet Ambient Sensors 2
RA91  GL5549  [RES-TH_L5.1-W4.3-P3.40-D0.5]
RA92  GL5549  [RES-TH_L5.1-W4.3-P3.40-D0.5]
RA93  GL5549  [RES-TH_L5.1-W4.3-P3.40-D0.5]
RA94  GL5549  [RES-TH_L5.1-W4.3-P3.40-D0.5]
RA95  GL5549  [RES-TH_L5.1-W4.3-P3.40-D0.5]
RA96  GL5549  [RES-TH_L5.1-W4.3-P3.40-D0.5]
RA97  GL5549  [RES-TH_L5.1-W4.3-P3.40-D0.5]
RA98  GL5549  [RES-TH_L5.1-W4.3-P3.40-D0.5]
RA99  GL5549  [RES-TH_L5.1-W4.3-P3.40-D0.5]
RAU91  470k  [R0603]
RAU92  470k  [R0603]
RAU93  470k  [R0603]
RAU94  470k  [R0603]
RAU95  470k  [R0603]
RAU96  470k  [R0603]
RAU97  470k  [R0603]
RAU98  470k  [R0603]
RAU99  470k  [R0603]
sheet Light Sensors 1
RLD11  270  [R0603]
RLD12  270  [R0603]
RLD13  270  [R0603]
RLD14  270  [R0603]
RLD15  270  [R0603]
RLD16  270  [R0603]
RLD17  270  [R0603]
RLD18  270  [R0603]
RLD19  270  [R0603]
RLD21  270  [R0603]
RLD22  270  [R0603]
RLD23  270  [R0603]
RLD24  270  [R0603]
RLD25  270  [R0603]
RLD26  270  [R0603]
RLD27  270  [R0603]
RLD28  270  [R0603]
RLD29  270  [R0603]
RLU11  47k  [R0603]
RLU12  47k  [R0603]
RLU13  47k  [R0603]
RLU14  47k  [R0603]
RLU15  47k  [R0603]
RLU16  47k  [R0603]
RLU17  47k  [R0603]
RLU18  47k  [R0603]
RLU19  47k  [R0603]
RLU21  47k  [R0603]
RLU22  47k  [R0603]
RLU23  47k  [R0603]
RLU24  47k  [R0603]
RLU25  47k  [R0603]
RLU26  47k  [R0603]
RLU27  47k  [R0603]
RLU28  47k  [R0603]
RLU29  47k  [R0603]
RPR11  RPR-220  [LED-TH_4P_RPR-220]
RPR12  RPR-220  [LED-TH_4P_RPR-220]
RPR13  RPR-220  [LED-TH_4P_RPR-220]
RPR14  RPR-220  [LED-TH_4P_RPR-220]
RPR15  RPR-220  [LED-TH_4P_RPR-220]
RPR16  RPR-220  [LED-TH_4P_RPR-220]
RPR17  RPR-220  [LED-TH_4P_RPR-220]
RPR18  RPR-220  [LED-TH_4P_RPR-220]
RPR19  RPR-220  [LED-TH_4P_RPR-220]
RPR21  RPR-220  [LED-TH_4P_RPR-220]
RPR22  RPR-220  [LED-TH_4P_RPR-220]
RPR23  RPR-220  [LED-TH_4P_RPR-220]
RPR24  RPR-220  [LED-TH_4P_RPR-220]
RPR25  RPR-220  [LED-TH_4P_RPR-220]
RPR26  RPR-220  [LED-TH_4P_RPR-220]
RPR27  RPR-220  [LED-TH_4P_RPR-220]
RPR28  RPR-220  [LED-TH_4P_RPR-220]
RPR29  RPR-220  [LED-TH_4P_RPR-220]
sheet Light Sensors 2
RLD31  270  [R0603]
RLD32  270  [R0603]
RLD33  270  [R0603]
RLD34  270  [R0603]
RLD35  270  [R0603]
RLD36  270  [R0603]
RLD37  270  [R0603]
RLD38  270  [R0603]
RLD39  270  [R0603]
RLD41  270  [R0603]
RLD42  270  [R0603]
RLD43  270  [R0603]
RLD44  270  [R0603]
RLD45  270  [R0603]
RLD46  270  [R0603]
RLD47  270  [R0603]
RLD48  270  [R0603]
RLD49  270  [R0603]
RLU31  47k  [R0603]
RLU32  47k  [R0603]
RLU33  47k  [R0603]
RLU34  47k  [R0603]
RLU35  47k  [R0603]
RLU36  47k  [R0603]
RLU37  47k  [R0603]
RLU38  47k  [R0603]
RLU39  47k  [R0603]
RLU41  47k  [R0603]
RLU42  47k  [R0603]
RLU43  47k  [R0603]
RLU44  47k  [R0603]
RLU45  47k  [R0603]
RLU46  47k  [R0603]
RLU47  47k  [R0603]
RLU48  47k  [R0603]
RLU49  47k  [R0603]
RPR31  RPR-220  [LED-TH_4P_RPR-220]
RPR32  RPR-220  [LED-TH_4P_RPR-220]
RPR33  RPR-220  [LED-TH_4P_RPR-220]
RPR34  RPR-220  [LED-TH_4P_RPR-220]
RPR35  RPR-220  [LED-TH_4P_RPR-220]
RPR36  RPR-220  [LED-TH_4P_RPR-220]
RPR37  RPR-220  [LED-TH_4P_RPR-220]
RPR38  RPR-220  [LED-TH_4P_RPR-220]
RPR39  RPR-220  [LED-TH_4P_RPR-220]
RPR41  RPR-220  [LED-TH_4P_RPR-220]
RPR42  RPR-220  [LED-TH_4P_RPR-220]
RPR43  RPR-220  [LED-TH_4P_RPR-220]
RPR44  RPR-220  [LED-TH_4P_RPR-220]
RPR45  RPR-220  [LED-TH_4P_RPR-220]
RPR46  RPR-220  [LED-TH_4P_RPR-220]
RPR47  RPR-220  [LED-TH_4P_RPR-220]
RPR48  RPR-220  [LED-TH_4P_RPR-220]
RPR49  RPR-220  [LED-TH_4P_RPR-220]
sheet Light Sensors 3
RLD51  270  [R0603]
RLD52  270  [R0603]
RLD53  270  [R0603]
RLD54  270  [R0603]
RLD55  270  [R0603]
RLD56  270  [R0603]
RLD57  270  [R0603]
RLD58  270  [R0603]
RLD59  270  [R0603]
RLD61  270  [R0603]
RLD62  270  [R0603]
RLD63  270  [R0603]
RLD64  270  [R0603]
RLD65  270  [R0603]
RLD66  270  [R0603]
RLD67  270  [R0603]
RLD68  270  [R0603]
RLD69  270  [R0603]
RLU51  47k  [R0603]
RLU52  47k  [R0603]
RLU53  47k  [R0603]
RLU54  47k  [R0603]
RLU55  47k  [R0603]
RLU56  47k  [R0603]
RLU57  47k  [R0603]
RLU58  47k  [R0603]
RLU59  47k  [R0603]
RLU61  47k  [R0603]
RLU62  47k  [R0603]
RLU63  47k  [R0603]
RLU64  47k  [R0603]
RLU65  47k  [R0603]
RLU66  47k  [R0603]
RLU67  47k  [R0603]
RLU68  47k  [R0603]
RLU69  47k  [R0603]
RPR51  RPR-220  [LED-TH_4P_RPR-220]
RPR52  RPR-220  [LED-TH_4P_RPR-220]
RPR53  RPR-220  [LED-TH_4P_RPR-220]
RPR54  RPR-220  [LED-TH_4P_RPR-220]
RPR55  RPR-220  [LED-TH_4P_RPR-220]
RPR56  RPR-220  [LED-TH_4P_RPR-220]
RPR57  RPR-220  [LED-TH_4P_RPR-220]
RPR58  RPR-220  [LED-TH_4P_RPR-220]
RPR59  RPR-220  [LED-TH_4P_RPR-220]
RPR61  RPR-220  [LED-TH_4P_RPR-220]
RPR62  RPR-220  [LED-TH_4P_RPR-220]
RPR63  RPR-220  [LED-TH_4P_RPR-220]
RPR64  RPR-220  [LED-TH_4P_RPR-220]
RPR65  RPR-220  [LED-TH_4P_RPR-220]
RPR66  RPR-220  [LED-TH_4P_RPR-220]
RPR67  RPR-220  [LED-TH_4P_RPR-220]
RPR68  RPR-220  [LED-TH_4P_RPR-220]
RPR69  RPR-220  [LED-TH_4P_RPR-220]
sheet Light Sensors 4
RLD71  270  [R0603]
RLD72  270  [R0603]
RLD73  270  [R0603]
RLD74  270  [R0603]
RLD75  270  [R0603]
RLD76  270  [R0603]
RLD77  270  [R0603]
RLD78  270  [R0603]
RLD79  270  [R0603]
RLD81  270  [R0603]
RLD82  270  [R0603]
RLD83  270  [R0603]
RLD84  270  [R0603]
RLD85  270  [R0603]
RLD86  270  [R0603]
RLD87  270  [R0603]
RLD88  270  [R0603]
RLD89  270  [R0603]
RLU71  47k  [R0603]
RLU72  47k  [R0603]
RLU73  47k  [R0603]
RLU74  47k  [R0603]
RLU75  47k  [R0603]
RLU76  47k  [R0603]
RLU77  47k  [R0603]
RLU78  47k  [R0603]
RLU79  47k  [R0603]
RLU81  47k  [R0603]
RLU82  47k  [R0603]
RLU83  47k  [R0603]
RLU84  47k  [R0603]
RLU85  47k  [R0603]
RLU86  47k  [R0603]
RLU87  47k  [R0603]
RLU88  47k  [R0603]
RLU89  47k  [R0603]
RPR71  RPR-220  [LED-TH_4P_RPR-220]
RPR72  RPR-220  [LED-TH_4P_RPR-220]
RPR73  RPR-220  [LED-TH_4P_RPR-220]
RPR74  RPR-220  [LED-TH_4P_RPR-220]
RPR75  RPR-220  [LED-TH_4P_RPR-220]
RPR76  RPR-220  [LED-TH_4P_RPR-220]
RPR77  RPR-220  [LED-TH_4P_RPR-220]
RPR78  RPR-220  [LED-TH_4P_RPR-220]
RPR79  RPR-220  [LED-TH_4P_RPR-220]
RPR81  RPR-220  [LED-TH_4P_RPR-220]
RPR82  RPR-220  [LED-TH_4P_RPR-220]
RPR83  RPR-220  [LED-TH_4P_RPR-220]
RPR84  RPR-220  [LED-TH_4P_RPR-220]
RPR85  RPR-220  [LED-TH_4P_RPR-220]
RPR86  RPR-220  [LED-TH_4P_RPR-220]
RPR87  RPR-220  [LED-TH_4P_RPR-220]
RPR88  RPR-220  [LED-TH_4P_RPR-220]
RPR89  RPR-220  [LED-TH_4P_RPR-220]
sheet Light Sensors 5
RLD91  270  [R0603]
RLD92  270  [R0603]
RLD93  270  [R0603]
RLD94  270  [R0603]
RLD95  270  [R0603]
RLD96  270  [R0603]
RLD97  270  [R0603]
RLD98  270  [R0603]
RLD99  270  [R0603]
RLU91  47k  [R0603]
RLU92  47k  [R0603]
RLU93  47k  [R0603]
RLU94  47k  [R0603]
RLU95  47k  [R0603]
RLU96  47k  [R0603]
RLU97  47k  [R0603]
RLU98  47k  [R0603]
RLU99  47k  [R0603]
RPR91  RPR-220  [LED-TH_4P_RPR-220]
RPR92  RPR-220  [LED-TH_4P_RPR-220]
RPR93  RPR-220  [LED-TH_4P_RPR-220]
RPR94  RPR-220  [LED-TH_4P_RPR-220]
RPR95  RPR-220  [LED-TH_4P_RPR-220]
RPR96  RPR-220  [LED-TH_4P_RPR-220]
RPR97  RPR-220  [LED-TH_4P_RPR-220]
RPR98  RPR-220  [LED-TH_4P_RPR-220]
RPR99  RPR-220  [LED-TH_4P_RPR-220]
sheet MUX
MA1  SN74LV4051ADR  [SOIC-16_L10.8-W4.5-P1.27-LS6.8-BL]
MA2  SN74LV4051ADR  [SOIC-16_L10.8-W4.5-P1.27-LS6.8-BL]
MA3  SN74LV4051ADR  [SOIC-16_L10.8-W4.5-P1.27-LS6.8-BL]
MA4  SN74LV4051ADR  [SOIC-16_L10.8-W4.5-P1.27-LS6.8-BL]
MA5  SN74LV4051ADR  [SOIC-16_L10.8-W4.5-P1.27-LS6.8-BL]
MA6  SN74LV4051ADR  [SOIC-16_L10.8-W4.5-P1.27-LS6.8-BL]
MA7  SN74LV4051ADR  [SOIC-16_L10.8-W4.5-P1.27-LS6.8-BL]
MA8  SN74LV4051ADR  [SOIC-16_L10.8-W4.5-P1.27-LS6.8-BL]
MA9  SN74LV4051ADR  [SOIC-16_L10.8-W4.5-P1.27-LS6.8-BL]
MA10  SN74LV4051ADR  [SOIC-16_L10.8-W4.5-P1.27-LS6.8-BL]
MA11  SN74LV4051ADR  [SOIC-16_L10.8-W4.5-P1.27-LS6.8-BL]
ML1  SN74LV4051ADR  [SOIC-16_L10.8-W4.5-P1.27-LS6.8-BL]
ML2  SN74LV4051ADR  [SOIC-16_L10.8-W4.5-P1.27-LS6.8-BL]
ML3  SN74LV4051ADR  [SOIC-16_L10.8-W4.5-P1.27-LS6.8-BL]
ML4  SN74LV4051ADR  [SOIC-16_L10.8-W4.5-P1.27-LS6.8-BL]
ML5  SN74LV4051ADR  [SOIC-16_L10.8-W4.5-P1.27-LS6.8-BL]
ML6  SN74LV4051ADR  [SOIC-16_L10.8-W4.5-P1.27-LS6.8-BL]
ML7  SN74LV4051ADR  [SOIC-16_L10.8-W4.5-P1.27-LS6.8-BL]
ML8  SN74LV4051ADR  [SOIC-16_L10.8-W4.5-P1.27-LS6.8-BL]
ML9  SN74LV4051ADR  [SOIC-16_L10.8-W4.5-P1.27-LS6.8-BL]
ML10  SN74LV4051ADR  [SOIC-16_L10.8-W4.5-P1.27-LS6.8-BL]
ML11  SN74LV4051ADR  [SOIC-16_L10.8-W4.5-P1.27-LS6.8-BL]
sheet uC
C1  1u/6.3V  [C0603]
C2  10u/10V  [C0603]
C3  1u/6.3V  [C0603]
C4  10u/10V  [C0603]
C5  100n/6.3V  [C0603]
C6  100n/6.3V  [C0603]
H1  HDR-F-2.54_1x2  [HDR-F-2.54_1X2]
H2  PZ254V-11-06P  [HDR-TH_6P-P2.54-V-M]
H3  HDR-F-2.54_1x2  [HDR-F-2.54_1X2]
LED1  LED-0603_R  [LED0603_RED]
Q1  YJL03G10A-F2-0000HF  [SOT-23-3_L2.9-W1.3-P1.90-LS2.4-BR]
Q2  YJL03G10A-F2-0000HF  [SOT-23-3_L2.9-W1.3-P1.90-LS2.4-BR]
Q3  YJL03G10A-F2-0000HF  [SOT-23-3_L2.9-W1.3-P1.90-LS2.4-BR]
Q4  YJL03G10A-F2-0000HF  [SOT-23-3_L2.9-W1.3-P1.90-LS2.4-BR]
Q5  YJL03G10A-F2-0000HF  [SOT-23-3_L2.9-W1.3-P1.90-LS2.4-BR]
Q6  YJL03G10A-F2-0000HF  [SOT-23-3_L2.9-W1.3-P1.90-LS2.4-BR]
Q7  YJL03G10A-F2-0000HF  [SOT-23-3_L2.9-W1.3-P1.90-LS2.4-BR]
Q8  YJL03G10A-F2-0000HF  [SOT-23-3_L2.9-W1.3-P1.90-LS2.4-BR]
Q9  YJL03G10A-F2-0000HF  [SOT-23-3_L2.9-W1.3-P1.90-LS2.4-BR]
R1  47k  [R0603]
R2  270  [R0603]
R3  47k  [R0603]
R4  47k  [R0603]
R5  47k  [R0603]
R6  47k  [R0603]
RS1  47k  [R0603]
RS2  47k  [R0603]
RS3  47k  [R0603]
RS4  47k  [R0603]
RS5  47k  [R0603]
RS6  47k  [R0603]
RS7  47k  [R0603]
RS8  47k  [R0603]
RS9  47k  [R0603]
U1  PIC16F18877-I/PT  [TQFP-44_L10.0-W10.0-P0.80-LS12.0-BL]
U2  LDLN030G33R  [LDLN030G33R]
U3  STM1061N19WX6F  [STM1061N19WX6F]
U4  BM71BLES1FC2-0B04AA  [BM71BLES1FC2]
USB1  47346-0001  [MICRO-USB-SMD_47346-0001]

## Library data of the parts
RA11-RA19 RA21-RA29 RA31-RA39 RA41-RA49 RA51-RA59 RA61-RA69 RA71-RA79 RA81-RA89 RA91-RA99 = GL5549: Supplier: LCSC; Manufacturer: Senba; Supplier Part: C125631
R1-R6 RAU11-RAU19 RAU21-RAU29 RAU31-RAU39 RAU41-RAU49 RAU51-RAU59 RAU61-RAU69 RAU71-RAU79 RAU81-RAU89 RAU91-RAU99 RLD11-RLD19 RLD21-RLD29 RLD31-RLD39 RLD41-RLD49 RLD51-RLD59 RLD61-RLD69 RLD71-RLD79 RLD81-RLD89 RLD91-RLD99 RLU11-RLU19 RLU21-RLU29 RLU31-RLU39 RLU41-RLU49 RLU51-RLU59 RLU61-RLU69 RLU71-RLU79 RLU81-RLU89 RLU91-RLU99 RS1-RS9 = R_0603_EU: Contributor: LCEDA_Lib
RPR11-RPR19 RPR21-RPR29 RPR31-RPR39 RPR41-RPR49 RPR51-RPR59 RPR61-RPR69 RPR71-RPR79 RPR81-RPR89 RPR91-RPR99 = RPR-220: Supplier: LCSC; Manufacturer: ROHM; image: //image.lceda.cn/szlcsc/C21062.jpg; Supplier Part: C21062; LCSC Assembly: Yes; SMT Type: Extend; Paste Type: expand; Package Display: No
MA1-MA11 ML1-ML11 = SN74LV4051ADR: Supplier: LCSC; Manufacturer: TI; Contributor: LCSC; Supplier Part: C128414; SMT Type: Extend; JLCPCB SMD: Yes; LCSC Assembly: Yes; Paste Type: expand
C1-C6 = C_0603_US: Contributor: LCEDA_Lib
H1 H3 = HDR-F-2.54_1x2: Supplier Part: C49661; Supplier: LCSC; Contributor: LCEDA_Lib
H2 = PZ254V-11-06P: Supplier: LCSC; Supplier Part: C492405; Manufacturer: XFCN; Contributor: LCSC; JLCPCB Part Class: Extended Part
LED1 = LED-0603_R: Manufacturer: EVERLIGHT(台湾亿光); Manufacturer Part: 19-217/R6C-AL1M2VY/3T; Supplier Part: C72044; Supplier: LCSC; Contributor: LCEDA_01
Q1-Q9 = YJL03G10A-F2-0000HF: Supplier: LCSC; Supplier Part: C919604; Manufacturer: YANGJIE(扬杰); Contributor: LCSC
U1 = PIC16F18877-I/PT: Supplier: LCSC; Manufacturer: MICROCHIP; Supplier Part: C81835; SMT Type: Extend; JLCPCB SMD: Yes; LCSC Assembly: Yes; Paste Type: expand
U2 = LDLN030G33R: Manufacturer: ST; Supplier: Element14; Contributor: lukwojnar
U3 = STM1061N19WX6F: Manufacturer: ST; Supplier: Element14; link: https://pl.farnell.com/stmicroelectronics/stm1061n19wx6f/mpu-supervisor-monitor-40-to-85deg/dp/3367224; Contributor: Łukasz Wojnarowski
U4 = BM71BLES1FC2-0B04AA: Manufacturer: Microchip; Supplier: Element14; link: https://pl.farnell.com/microchip/bm71bles1fc2-0b04aa/bluetooth-module-v4-2-2-402-2/dp/2907903; Contributor: Łukasz Wojnarowski
USB1 = 47346-0001: Supplier: LCSC; Supplier Part: C132560; Manufacturer: MOLEX; Contributor: LCSC

## Nets
3.3V: C2.2 C3.2 C5.2 C6.1 H2.2 MA1.16(VCC) MA2.16(VCC) MA3.16(VCC) MA4.16(VCC) MA5.16(VCC) MA6.16(VCC) MA7.16(VCC) MA8.16(VCC) MA9.16(VCC) MA10.16(VCC) MA11.16(VCC) ML1.16(VCC) ML2.16(VCC) ML3.16(VCC) ML4.16(VCC) ML5.16(VCC) ML6.16(VCC) ML7.16(VCC) ML8.16(VCC) ML9.16(VCC) ML10.16(VCC) ML11.16(VCC) R1.2 R2.2 R3.2 R5.2 R6.1 RAU11.2 RAU12.2 RAU13.2 RAU14.2 RAU15.2 RAU16.2 RAU17.1 RAU18.1 RAU19.1 RAU21.2 RAU22.2 RAU23.2 RAU24.2 RAU25.2 RAU26.2 RAU27.2 RAU28.2 RAU29.2 RAU31.1 RAU32.1 RAU33.1 RAU34.1 RAU35.1 RAU36.1 RAU37.1 RAU38.1 RAU39.1 RAU41.2 RAU42.2 RAU43.2 RAU44.2 RAU45.2 RAU46.2 RAU47.2 RAU48.2 RAU49.2 RAU51.1 RAU52.1 RAU53.1 RAU54.1 RAU55.1 RAU56.1 RAU57.1 RAU58.1 RAU59.1 RAU61.2 RAU62.2 RAU63.2 RAU64.2 RAU65.2 RAU66.2 RAU67.2 RAU68.2 RAU69.2 RAU71.1 RAU72.1 RAU73.1 RAU74.1 RAU75.1 RAU76.1 RAU77.1 RAU78.1 RAU79.1 RAU81.2 RAU82.2 RAU83.2 RAU84.2 RAU85.2 RAU86.2 RAU87.2 RAU88.2 RAU89.2 RAU91.1 RAU92.1 RAU93.1 RAU94.1 RAU95.1 RAU96.1 RAU97.1 RAU98.1 RAU99.1 RLU11.2 RLU12.2 RLU13.2 RLU14.1 RLU15.1 RLU16.1 RLU17.1 RLU18.1 RLU19.1 RLU21.2 RLU22.2 RLU23.2 RLU24.2 RLU25.2 RLU26.2 RLU27.1 RLU28.1 RLU29.1 RLU31.2 RLU32.2 RLU33.2 RLU34.1 RLU35.1 RLU36.1 RLU37.1 RLU38.1 RLU39.1 RLU41.2 RLU42.2 RLU43.2 RLU44.2 RLU45.2 RLU46.2 RLU47.1 RLU48.1 RLU49.1 RLU51.2 RLU52.2 RLU53.2 RLU54.1 RLU55.1 RLU56.1 RLU57.1 RLU58.1 RLU59.1 RLU61.2 RLU62.2 RLU63.2 RLU64.2 RLU65.2 RLU66.2 RLU67.1 RLU68.1 RLU69.1 RLU71.2 RLU72.2 RLU73.2 RLU74.1 RLU75.1 RLU76.1 RLU77.1 RLU78.1 RLU79.1 RLU81.2 RLU82.2 RLU83.2 RLU84.2 RLU85.2 RLU86.2 RLU87.1 RLU88.1 RLU89.1 RLU91.2 RLU92.2 RLU93.2 RLU94.1 RLU95.1 RLU96.1 RLU97.1 RLU98.1 RLU99.1 U1.7(VDD) U1.28(VDD) U2.4(OUT) U3.3(VDD) U4.14(VBAT)
5V: C4.2 H1.1 R4.2 RPR11.1(Ano) RPR12.1(Ano) RPR13.1(Ano) RPR14.1(Ano) RPR15.1(Ano) RPR16.1(Ano) RPR17.1(Ano) RPR18.1(Ano) RPR19.1(Ano) RPR21.1(Ano) RPR22.1(Ano) RPR23.1(Ano) RPR24.1(Ano) RPR25.1(Ano) RPR26.1(Ano) RPR27.1(Ano) RPR28.1(Ano) RPR29.1(Ano) RPR31.1(Ano) RPR32.1(Ano) RPR33.1(Ano) RPR34.1(Ano) RPR35.1(Ano) RPR36.1(Ano) RPR37.1(Ano) RPR38.1(Ano) RPR39.1(Ano) RPR41.1(Ano) RPR42.1(Ano) RPR43.1(Ano) RPR44.1(Ano) RPR45.1(Ano) RPR46.1(Ano) RPR47.1(Ano) RPR48.1(Ano) RPR49.1(Ano) RPR51.1(Ano) RPR52.1(Ano) RPR53.1(Ano) RPR54.1(Ano) RPR55.1(Ano) RPR56.1(Ano) RPR57.1(Ano) RPR58.1(Ano) RPR59.1(Ano) RPR61.1(Ano) RPR62.1(Ano) RPR63.1(Ano) RPR64.1(Ano) RPR65.1(Ano) RPR66.1(Ano) RPR67.1(Ano) RPR68.1(Ano) RPR69.1(Ano) RPR71.1(Ano) RPR72.1(Ano) RPR73.1(Ano) RPR74.1(Ano) RPR75.1(Ano) RPR76.1(Ano) RPR77.1(Ano) RPR78.1(Ano) RPR79.1(Ano) RPR81.1(Ano) RPR82.1(Ano) RPR83.1(Ano) RPR84.1(Ano) RPR85.1(Ano) RPR86.1(Ano) RPR87.1(Ano) RPR88.1(Ano) RPR89.1(Ano) RPR91.1(Ano) RPR92.1(Ano) RPR93.1(Ano) RPR94.1(Ano) RPR95.1(Ano) RPR96.1(Ano) RPR97.1(Ano) RPR98.1(Ano) RPR99.1(Ano) U2.1(IN)
GND: C1.1 C2.1 C3.1 C4.1 C5.1 C6.2 H2.3 H3.1 MA1.6(INH) MA1.7(GND) MA1.8(GND) MA2.6(INH) MA2.7(GND) MA2.8(GND) MA3.6(INH) MA3.7(GND) MA3.8(GND) MA4.6(INH) MA4.7(GND) MA4.8(GND) MA5.6(INH) MA5.7(GND) MA5.8(GND) MA6.6(INH) MA6.7(GND) MA6.8(GND) MA7.6(INH) MA7.7(GND) MA7.8(GND) MA8.6(INH) MA8.7(GND) MA8.8(GND) MA9.6(INH) MA9.7(GND) MA9.8(GND) MA10.6(INH) MA10.7(GND) MA10.8(GND) MA11.6(INH) MA11.7(GND) MA11.8(GND) ML1.6(INH) ML1.7(GND) ML1.8(GND) ML2.6(INH) ML2.7(GND) ML2.8(GND) ML3.6(INH) ML3.7(GND) ML3.8(GND) ML4.6(INH) ML4.7(GND) ML4.8(GND) ML5.6(INH) ML5.7(GND) ML5.8(GND) ML6.6(INH) ML6.7(GND) ML6.8(GND) ML7.6(INH) ML7.7(GND) ML7.8(GND) ML8.6(INH) ML8.7(GND) ML8.8(GND) ML9.6(INH) ML9.7(GND) ML9.8(GND) ML10.6(INH) ML10.7(GND) ML10.8(GND) ML11.6(INH) ML11.7(GND) ML11.8(GND) Q1.2(S) Q2.2(S) Q3.2(S) Q4.2(S) Q5.2(S) Q6.2(S) Q7.2(S) Q8.2(S) Q9.2(S) RA11.1 RA12.1 RA13.1 RA14.1 RA15.1 RA16.1 RA17.1 RA18.1 RA19.1 RA21.1 RA22.1 RA23.1 RA24.1 RA25.1 RA26.1 RA27.1 RA28.1 RA29.1 RA31.1 RA32.1 RA33.1 RA34.1 RA35.1 RA36.1 RA37.1 RA38.1 RA39.1 RA41.1 RA42.1 RA43.1 RA44.1 RA45.1 RA46.1 RA47.1 RA48.1 RA49.1 RA51.1 RA52.1 RA53.1 RA54.1 RA55.1 RA56.1 RA57.1 RA58.1 RA59.1 RA61.1 RA62.1 RA63.1 RA64.1 RA65.1 RA66.1 RA67.1 RA68.1 RA69.1 RA71.1 RA72.1 RA73.1 RA74.1 RA75.1 RA76.1 RA77.1 RA78.1 RA79.1 RA81.1 RA82.1 RA83.1 RA84.1 RA85.1 RA86.1 RA87.1 RA88.1 RA89.1 RA91.1 RA92.1 RA93.1 RA94.1 RA95.1 RA96.1 RA97.1 RA98.1 RA99.1 RPR11.3(Em) RPR12.3(Em) RPR13.3(Em) RPR14.3(Em) RPR15.3(Em) RPR16.3(Em) RPR17.3(Em) RPR18.3(Em) RPR19.3(Em) RPR21.3(Em) RPR22.3(Em) RPR23.3(Em) RPR24.3(Em) RPR25.3(Em) RPR26.3(Em) RPR27.3(Em) RPR28.3(Em) RPR29.3(Em) RPR31.3(Em) RPR32.3(Em) RPR33.3(Em) RPR34.3(Em) RPR35.3(Em) RPR36.3(Em) RPR37.3(Em) RPR38.3(Em) RPR39.3(Em) RPR41.3(Em) RPR42.3(Em) RPR43.3(Em) RPR44.3(Em) RPR45.3(Em) RPR46.3(Em) RPR47.3(Em) RPR48.3(Em) RPR49.3(Em) RPR51.3(Em) RPR52.3(Em) RPR53.3(Em) RPR54.3(Em) RPR55.3(Em) RPR56.3(Em) RPR57.3(Em) RPR58.3(Em) RPR59.3(Em) RPR61.3(Em) RPR62.3(Em) RPR63.3(Em) RPR64.3(Em) RPR65.3(Em) RPR66.3(Em) RPR67.3(Em) RPR68.3(Em) RPR69.3(Em) RPR71.3(Em) RPR72.3(Em) RPR73.3(Em) RPR74.3(Em) RPR75.3(Em) RPR76.3(Em) RPR77.3(Em) RPR78.3(Em) RPR79.3(Em) RPR81.3(Em) RPR82.3(Em) RPR83.3(Em) RPR84.3(Em) RPR85.3(Em) RPR86.3(Em) RPR87.3(Em) RPR88.3(Em) RPR89.3(Em) RPR91.3(Em) RPR92.3(Em) RPR93.3(Em) RPR94.3(Em) RPR95.3(Em) RPR96.3(Em) RPR97.3(Em) RPR98.3(Em) RPR99.3(Em) U1.6(VSS) U1.29(VSS) U2.2(GND) U3.2(GND) U4.2(GND) U4.13(GND) USB1.5(GND) USB1.6
AS11: MA1.1(Y4) RA11.2 RAU11.1
AS12: MA1.2(Y6) RA12.2 RAU12.1
AS13: MA1.4(Y7) RA13.2 RAU13.1
AS14: MA1.5(Y5) RA14.2 RAU14.1
AS15: MA1.12(Y3) RA15.2 RAU15.1
AS16: MA1.13(Y0) RA16.2 RAU16.1
AS17: MA1.14(Y1) RA17.2 RAU17.2
AS18: MA1.15(Y2) RA18.2 RAU18.2
AS19: MA10.1(Y4) RA19.2 RAU19.2
AS21: MA2.1(Y4) RA21.2 RAU21.1
AS22: MA2.2(Y6) RA22.2 RAU22.1
AS23: MA2.4(Y7) RA23.2 RAU23.1
AS24: MA2.5(Y5) RA24.2 RAU24.1
AS25: MA2.12(Y3) RA25.2 RAU25.1
AS26: MA2.13(Y0) RA26.2 RAU26.1
AS27: MA2.14(Y1) RA27.2 RAU27.1
AS28: MA2.15(Y2) RA28.2 RAU28.1
AS29: MA10.2(Y6) RA29.2 RAU29.1
AS31: MA3.1(Y4) RA31.2 RAU31.2
AS32: MA3.2(Y6) RA32.2 RAU32.2
AS33: MA3.4(Y7) RA33.2 RAU33.2
AS34: MA3.5(Y5) RA34.2 RAU34.2
AS35: MA3.12(Y3) RA35.2 RAU35.2
AS36: MA3.13(Y0) RA36.2 RAU36.2
AS37: MA3.14(Y1) RA37.2 RAU37.2
AS38: MA3.15(Y2) RA38.2 RAU38.2
AS39: MA10.4(Y7) RA39.2 RAU39.2
AS41: MA4.1(Y4) RA41.2 RAU41.1
AS42: MA4.2(Y6) RA42.2 RAU42.1
AS43: MA4.4(Y7) RA43.2 RAU43.1
AS44: MA4.5(Y5) RA44.2 RAU44.1
AS45: MA4.12(Y3) RA45.2 RAU45.1
AS46: MA4.13(Y0) RA46.2 RAU46.1
AS47: MA4.14(Y1) RA47.2 RAU47.1
AS48: MA4.15(Y2) RA48.2 RAU48.1
AS49: MA10.5(Y5) RA49.2 RAU49.1
AS51: MA5.1(Y4) RA51.2 RAU51.2
AS52: MA5.2(Y6) RA52.2 RAU52.2
AS53: MA5.4(Y7) RA53.2 RAU53.2
AS54: MA5.5(Y5) RA54.2 RAU54.2
AS55: MA5.12(Y3) RA55.2 RAU55.2
AS56: MA5.13(Y0) RA56.2 RAU56.2
AS57: MA5.14(Y1) RA57.2 RAU57.2
AS58: MA5.15(Y2) RA58.2 RAU58.2
AS59: MA10.12(Y3) RA59.2 RAU59.2
AS61: MA6.1(Y4) RA61.2 RAU61.1
AS62: MA6.2(Y6) RA62.2 RAU62.1
AS63: MA6.4(Y7) RA63.2 RAU63.1
AS64: MA6.5(Y5) RA64.2 RAU64.1
AS65: MA6.12(Y3) RA65.2 RAU65.1
AS66: MA6.13(Y0) RA66.2 RAU66.1
AS67: MA6.14(Y1) RA67.2 RAU67.1
AS68: MA6.15(Y2) RA68.2 RAU68.1
AS69: MA10.13(Y0) RA69.2 RAU69.1
AS71: MA7.1(Y4) RA71.2 RAU71.2
AS72: MA7.2(Y6) RA72.2 RAU72.2
AS73: MA7.4(Y7) RA73.2 RAU73.2
AS74: MA7.5(Y5) RA74.2 RAU74.2
AS75: MA7.12(Y3) RA75.2 RAU75.2
AS76: MA7.13(Y0) RA76.2 RAU76.2
AS77: MA7.14(Y1) RA77.2 RAU77.2
AS78: MA7.15(Y2) RA78.2 RAU78.2
AS79: MA10.14(Y1) RA79.2 RAU79.2
AS81: MA8.1(Y4) RA81.2 RAU81.1
AS82: MA8.2(Y6) RA82.2 RAU82.1
AS83: MA8.4(Y7) RA83.2 RAU83.1
AS84: MA8.5(Y5) RA84.2 RAU84.1
AS85: MA8.12(Y3) RA85.2 RAU85.1
AS86: MA8.13(Y0) RA86.2 RAU86.1
AS87: MA8.14(Y1) RA87.2 RAU87.1
AS88: MA8.15(Y2) RA88.2 RAU88.1
AS89: MA10.15(Y2) RA89.2 RAU89.1
AS91: MA9.1(Y4) RA91.2 RAU91.2
AS92: MA9.2(Y6) RA92.2 RAU92.2
AS93: MA9.4(Y7) RA93.2 RAU93.2
AS94: MA9.5(Y5) RA94.2 RAU94.2
AS95: MA9.12(Y3) RA95.2 RAU95.2
AS96: MA9.13(Y0) RA96.2 RAU96.2
AS97: MA9.14(Y1) RA97.2 RAU97.2
AS98: MA9.15(Y2) RA98.2 RAU98.2
AS99: RA99.2 RAU99.2 U1.22(RA3)
AS_O1: MA1.3(COM) MA11.1(Y4)
AS_O2: MA2.3(COM) MA11.2(Y6)
AS_O3: MA3.3(COM) MA11.4(Y7)
AS_O4: MA4.3(COM) MA11.5(Y5)
AS_O5: MA5.3(COM) MA11.12(Y3)
AS_O6: MA6.3(COM) MA11.13(Y0)
AS_O7: MA7.3(COM) MA11.14(Y1)
AS_O8: MA8.3(COM) MA11.15(Y2)
AS_O9: MA9.3(COM) U1.5(RD7)
AS_O10: MA10.3(COM) U1.26(RE1)
AS_OM: MA11.3(COM) U1.9(RB1)
CTS: U1.39(RD1) U4.11(P0_0)
HCI_RXD: U1.43(RC5) U4.7(HCI_RXD)
HCI_TXD: U1.42(RC4) U4.8(HCI_TXD)
ICSPCLK: H2.5 U1.16(ICSPCLK/RB6)
ICSPDAT: H2.4 U1.17(ICSPDAT/RB7)
IR1: Q1.3(D) RLD11.1 RLD12.1 RLD13.1 RLD14.2 RLD21.1 RLD22.1 RLD23.1 RLD24.1
IR2: Q2.3(D) RLD15.2 RLD16.2 RLD17.2 RLD18.2 RLD19.2 RLD25.1 RLD26.1 RLD27.1 RLD28.1 RLD29.1
IR3: Q3.3(D) RLD31.2 RLD32.2 RLD33.2 RLD34.2 RLD41.1 RLD42.1 RLD43.1 RLD44.1
IR4: Q4.3(D) RLD35.2 RLD36.2 RLD37.2 RLD38.2 RLD39.2 RLD45.1 RLD46.1 RLD47.1 RLD48.1 RLD49.1
IR5: Q5.3(D) RLD51.2 RLD52.2 RLD53.2 RLD54.2 RLD61.1 RLD62.1 RLD63.1 RLD64.1
IR6: Q6.3(D) RLD55.2 RLD56.2 RLD57.2 RLD58.2 RLD59.2 RLD65.1 RLD66.1 RLD67.1 RLD68.1 RLD69.1
IR7: Q7.3(D) RLD71.2 RLD72.2 RLD73.2 RLD74.2 RLD81.1 RLD82.1 RLD83.1 RLD84.1
IR8: Q8.3(D) RLD75.2 RLD76.2 RLD77.2 RLD78.2 RLD79.2 RLD85.1 RLD86.1 RLD87.1 RLD88.1 RLD89.1
IR9: Q9.3(D) RLD91.2 RLD92.2 RLD93.2 RLD94.2 RLD95.2 RLD96.2 RLD97.2 RLD98.2 RLD99.2
IRS1: RS1.1 U1.35(RC1)
IRS2: RS2.1 U1.30(RA7)
IRS3: RS3.1 U1.36(RC2)
IRS4: RS4.1 U1.25(RE0)
IRS5: RS5.1 U1.37(RC3)
IRS6: RS6.1 U1.24(RA5)
IRS7: RS7.1 U1.38(RD0)
IRS8: RS8.1 U1.23(RA4)
IRS9: RS9.1 U1.3(RD5)
LINK_DROP: H3.2 R6.2 U4.3(P1_2)
LS11: ML1.1(Y4) RLU11.1 RPR11.4(Col)
LS12: ML1.2(Y6) RLU12.1 RPR12.4(Col)
LS13: ML1.4(Y7) RLU13.1 RPR13.4(Col)
LS14: ML1.5(Y5) RLU14.2 RPR14.4(Col)
LS15: ML1.12(Y3) RLU15.2 RPR15.4(Col)
LS16: ML1.13(Y0) RLU16.2 RPR16.4(Col)
LS17: ML1.14(Y1) RLU17.2 RPR17.4(Col)
LS18: ML1.15(Y2) RLU18.2 RPR18.4(Col)
LS19: ML10.1(Y4) RLU19.2 RPR19.4(Col)
LS21: ML2.1(Y4) RLU21.1 RPR21.4(Col)
LS22: ML2.2(Y6) RLU22.1 RPR22.4(Col)
LS23: ML2.4(Y7) RLU23.1 RPR23.4(Col)
LS24: ML2.5(Y5) RLU24.1 RPR24.4(Col)
LS25: ML2.12(Y3) RLU25.1 RPR25.4(Col)
LS26: ML2.13(Y0) RLU26.1 RPR26.4(Col)
LS27: ML2.14(Y1) RLU27.2 RPR27.4(Col)
LS28: ML2.15(Y2) RLU28.2 RPR28.4(Col)
LS29: ML10.2(Y6) RLU29.2 RPR29.4(Col)
LS31: ML3.1(Y4) RLU31.1 RPR31.4(Col)
LS32: ML3.2(Y6) RLU32.1 RPR32.4(Col)
LS33: ML3.4(Y7) RLU33.1 RPR33.4(Col)
LS34: ML3.5(Y5) RLU34.2 RPR34.4(Col)
LS35: ML3.12(Y3) RLU35.2 RPR35.4(Col)
LS36: ML3.13(Y0) RLU36.2 RPR36.4(Col)
LS37: ML3.14(Y1) RLU37.2 RPR37.4(Col)
LS38: ML3.15(Y2) RLU38.2 RPR38.4(Col)
LS39: ML10.4(Y7) RLU39.2 RPR39.4(Col)
LS41: ML4.1(Y4) RLU41.1 RPR41.4(Col)
LS42: ML4.2(Y6) RLU42.1 RPR42.4(Col)
LS43: ML4.4(Y7) RLU43.1 RPR43.4(Col)
LS44: ML4.5(Y5) RLU44.1 RPR44.4(Col)
LS45: ML4.12(Y3) RLU45.1 RPR45.4(Col)
LS46: ML4.13(Y0) RLU46.1 RPR46.4(Col)
LS47: ML4.14(Y1) RLU47.2 RPR47.4(Col)
LS48: ML4.15(Y2) RLU48.2 RPR48.4(Col)
LS49: ML10.5(Y5) RLU49.2 RPR49.4(Col)
LS51: ML5.1(Y4) RLU51.1 RPR51.4(Col)
LS52: ML5.2(Y6) RLU52.1 RPR52.4(Col)
LS53: ML5.4(Y7) RLU53.1 RPR53.4(Col)
LS54: ML5.5(Y5) RLU54.2 RPR54.4(Col)
LS55: ML5.12(Y3) RLU55.2 RPR55.4(Col)
LS56: ML5.13(Y0) RLU56.2 RPR56.4(Col)
LS57: ML5.14(Y1) RLU57.2 RPR57.4(Col)
LS58: ML5.15(Y2) RLU58.2 RPR58.4(Col)
LS59: ML10.12(Y3) RLU59.2 RPR59.4(Col)
LS61: ML6.1(Y4) RLU61.1 RPR61.4(Col)
LS62: ML6.2(Y6) RLU62.1 RPR62.4(Col)
LS63: ML6.4(Y7) RLU63.1 RPR63.4(Col)
LS64: ML6.5(Y5) RLU64.1 RPR64.4(Col)
LS65: ML6.12(Y3) RLU65.1 RPR65.4(Col)
LS66: ML6.13(Y0) RLU66.1 RPR66.4(Col)
LS67: ML6.14(Y1) RLU67.2 RPR67.4(Col)
LS68: ML6.15(Y2) RLU68.2 RPR68.4(Col)
LS69: ML10.13(Y0) RLU69.2 RPR69.4(Col)
LS71: ML7.1(Y4) RLU71.1 RPR71.4(Col)
LS72: ML7.2(Y6) RLU72.1 RPR72.4(Col)
LS73: ML7.4(Y7) RLU73.1 RPR73.4(Col)
LS74: ML7.5(Y5) RLU74.2 RPR74.4(Col)
LS75: ML7.12(Y3) RLU75.2 RPR75.4(Col)
LS76: ML7.13(Y0) RLU76.2 RPR76.4(Col)
LS77: ML7.14(Y1) RLU77.2 RPR77.4(Col)
LS78: ML7.15(Y2) RLU78.2 RPR78.4(Col)
LS79: ML10.14(Y1) RLU79.2 RPR79.4(Col)
LS81: ML8.1(Y4) RLU81.1 RPR81.4(Col)
LS82: ML8.2(Y6) RLU82.1 RPR82.4(Col)
LS83: ML8.4(Y7) RLU83.1 RPR83.4(Col)
LS84: ML8.5(Y5) RLU84.1 RPR84.4(Col)
LS85: ML8.12(Y3) RLU85.1 RPR85.4(Col)
LS86: ML8.13(Y0) RLU86.1 RPR86.4(Col)
LS87: ML8.14(Y1) RLU87.2 RPR87.4(Col)
LS88: ML8.15(Y2) RLU88.2 RPR88.4(Col)
LS89: ML10.15(Y2) RLU89.2 RPR89.4(Col)
LS91: ML9.1(Y4) RLU91.1 RPR91.4(Col)
LS92: ML9.2(Y6) RLU92.1 RPR92.4(Col)
LS93: ML9.4(Y7) RLU93.1 RPR93.4(Col)
LS94: ML9.5(Y5) RLU94.2 RPR94.4(Col)
LS95: ML9.12(Y3) RLU95.2 RPR95.4(Col)
LS96: ML9.13(Y0) RLU96.2 RPR96.4(Col)
LS97: ML9.14(Y1) RLU97.2 RPR97.4(Col)
LS98: ML9.15(Y2) RLU98.2 RPR98.4(Col)
LS99: RLU99.2 RPR99.4(Col) U1.1(RC7)
LS_O1: ML1.3(COM) ML11.1(Y4)
LS_O2: ML2.3(COM) ML11.2(Y6)
LS_O3: ML3.3(COM) ML11.4(Y7)
LS_O4: ML4.3(COM) ML11.5(Y5)
LS_O5: ML5.3(COM) ML11.12(Y3)
LS_O6: ML6.3(COM) ML11.13(Y0)
LS_O7: ML7.3(COM) ML11.14(Y1)
LS_O8: ML8.3(COM) ML11.15(Y2)
LS_O9: ML9.3(COM) U1.8(RB0)
LS_O10: ML10.3(COM) U1.27(RE2)
LS_OM: ML11.3(COM) U1.10(RB2)
MCLR_N: H2.1 R5.1 U1.18(VPP/MCLR#/RE3)
RST_N: C1.2 R1.1 U1.40(RD2) U3.1(OUT_N) U4.10(RST_N)
RTS: U1.41(RD3) U4.9(P3_6)
S1: MA1.11(A) MA2.11(A) MA3.11(A) MA4.11(A) MA5.11(A) MA6.11(A) MA7.11(A) MA8.11(A) MA9.11(A) MA10.11(A) ML1.11(A) ML2.11(A) ML3.11(A) ML4.11(A) ML5.11(A) ML6.11(A) ML7.11(A) ML8.11(A) ML9.11(A) ML10.11(A) U1.19(AN0/RA0)
S2: MA1.10(B) MA2.10(B) MA3.10(B) MA4.10(B) MA5.10(B) MA6.10(B) MA7.10(B) MA8.10(B) MA9.10(B) MA10.10(B) ML1.10(B) ML2.10(B) ML3.10(B) ML4.10(B) ML5.10(B) ML6.10(B) ML7.10(B) ML8.10(B) ML9.10(B) ML10.10(B) U1.20(RA1)
S3: MA1.9(C) MA2.9(C) MA3.9(C) MA4.9(C) MA5.9(C) MA6.9(C) MA7.9(C) MA8.9(C) MA9.9(C) MA10.9(C) ML1.9(C) ML2.9(C) ML3.9(C) ML4.9(C) ML5.9(C) ML6.9(C) ML7.9(C) ML8.9(C) ML9.9(C) ML10.9(C) U1.21(RA2)
S4: MA11.11(A) ML11.11(A) U1.11(RB3)
S5: MA11.10(B) ML11.10(B) U1.14(RB4)
S6: MA11.9(C) ML11.9(C) U1.15(RB5)
STATUS1: U1.4(RD6) U4.4(P1_3)
STATUS2: U1.2(RD4) U4.5(P1_7)
SYS_CON: U1.32(RC0) U4.16(P2_0)
TRANS: U1.31(RA6) U4.15(P2_7)
WAKE_UP: U1.44(RC6) U4.6(P1)
Net-(H1-2): H1.2 USB1.1(VBUS)
Net-(LED1-1): LED1.1 R2.1
Net-(LED1-2): LED1.2 U4.12(P0_2)
Net-(Q1-1): Q1.1(G) RS1.2
Net-(Q2-1): Q2.1(G) RS2.2
Net-(Q3-1): Q3.1(G) RS3.2
Net-(Q4-1): Q4.1(G) RS4.2
Net-(Q5-1): Q5.1(G) RS5.2
Net-(Q6-1): Q6.1(G) RS6.2
Net-(Q7-1): Q7.1(G) RS7.2
Net-(Q8-1): Q8.1(G) RS8.2
Net-(Q9-1): Q9.1(G) RS9.2
Net-(R3-1): R3.1 U2.5(PG)
Net-(R4-1): R4.1 U2.3(EN)
Net-(RLD11-2): RLD11.2 RPR11.2(Cat)
Net-(RLD12-2): RLD12.2 RPR12.2(Cat)
Net-(RLD13-2): RLD13.2 RPR13.2(Cat)
Net-(RLD14-1): RLD14.1 RPR14.2(Cat)
Net-(RLD15-1): RLD15.1 RPR15.2(Cat)
Net-(RLD16-1): RLD16.1 RPR16.2(Cat)
Net-(RLD17-1): RLD17.1 RPR17.2(Cat)
Net-(RLD18-1): RLD18.1 RPR18.2(Cat)
Net-(RLD19-1): RLD19.1 RPR19.2(Cat)
Net-(RLD21-2): RLD21.2 RPR21.2(Cat)
Net-(RLD22-2): RLD22.2 RPR22.2(Cat)
Net-(RLD23-2): RLD23.2 RPR23.2(Cat)
Net-(RLD24-2): RLD24.2 RPR24.2(Cat)
Net-(RLD25-2): RLD25.2 RPR25.2(Cat)
Net-(RLD26-2): RLD26.2 RPR26.2(Cat)
Net-(RLD27-2): RLD27.2 RPR27.2(Cat)
Net-(RLD28-2): RLD28.2 RPR28.2(Cat)
Net-(RLD29-2): RLD29.2 RPR29.2(Cat)
Net-(RLD31-1): RLD31.1 RPR31.2(Cat)
Net-(RLD32-1): RLD32.1 RPR32.2(Cat)
Net-(RLD33-1): RLD33.1 RPR33.2(Cat)
Net-(RLD34-1): RLD34.1 RPR34.2(Cat)
Net-(RLD35-1): RLD35.1 RPR35.2(Cat)
Net-(RLD36-1): RLD36.1 RPR36.2(Cat)
Net-(RLD37-1): RLD37.1 RPR37.2(Cat)
Net-(RLD38-1): RLD38.1 RPR38.2(Cat)
Net-(RLD39-1): RLD39.1 RPR39.2(Cat)
Net-(RLD41-2): RLD41.2 RPR41.2(Cat)
Net-(RLD42-2): RLD42.2 RPR42.2(Cat)
Net-(RLD43-2): RLD43.2 RPR43.2(Cat)
Net-(RLD44-2): RLD44.2 RPR44.2(Cat)
Net-(RLD45-2): RLD45.2 RPR45.2(Cat)
Net-(RLD46-2): RLD46.2 RPR46.2(Cat)
Net-(RLD47-2): RLD47.2 RPR47.2(Cat)
Net-(RLD48-2): RLD48.2 RPR48.2(Cat)
Net-(RLD49-2): RLD49.2 RPR49.2(Cat)
Net-(RLD51-1): RLD51.1 RPR51.2(Cat)
Net-(RLD52-1): RLD52.1 RPR52.2(Cat)
Net-(RLD53-1): RLD53.1 RPR53.2(Cat)
Net-(RLD54-1): RLD54.1 RPR54.2(Cat)
Net-(RLD55-1): RLD55.1 RPR55.2(Cat)
Net-(RLD56-1): RLD56.1 RPR56.2(Cat)
Net-(RLD57-1): RLD57.1 RPR57.2(Cat)
Net-(RLD58-1): RLD58.1 RPR58.2(Cat)
Net-(RLD59-1): RLD59.1 RPR59.2(Cat)
Net-(RLD61-2): RLD61.2 RPR61.2(Cat)
Net-(RLD62-2): RLD62.2 RPR62.2(Cat)
Net-(RLD63-2): RLD63.2 RPR63.2(Cat)
Net-(RLD64-2): RLD64.2 RPR64.2(Cat)
Net-(RLD65-2): RLD65.2 RPR65.2(Cat)
Net-(RLD66-2): RLD66.2 RPR66.2(Cat)
Net-(RLD67-2): RLD67.2 RPR67.2(Cat)
Net-(RLD68-2): RLD68.2 RPR68.2(Cat)
Net-(RLD69-2): RLD69.2 RPR69.2(Cat)
Net-(RLD71-1): RLD71.1 RPR71.2(Cat)
Net-(RLD72-1): RLD72.1 RPR72.2(Cat)
Net-(RLD73-1): RLD73.1 RPR73.2(Cat)
Net-(RLD74-1): RLD74.1 RPR74.2(Cat)
Net-(RLD75-1): RLD75.1 RPR75.2(Cat)
Net-(RLD76-1): RLD76.1 RPR76.2(Cat)
Net-(RLD77-1): RLD77.1 RPR77.2(Cat)
Net-(RLD78-1): RLD78.1 RPR78.2(Cat)
Net-(RLD79-1): RLD79.1 RPR79.2(Cat)
Net-(RLD81-2): RLD81.2 RPR81.2(Cat)
Net-(RLD82-2): RLD82.2 RPR82.2(Cat)
Net-(RLD83-2): RLD83.2 RPR83.2(Cat)
Net-(RLD84-2): RLD84.2 RPR84.2(Cat)
Net-(RLD85-2): RLD85.2 RPR85.2(Cat)
Net-(RLD86-2): RLD86.2 RPR86.2(Cat)
Net-(RLD87-2): RLD87.2 RPR87.2(Cat)
Net-(RLD88-2): RLD88.2 RPR88.2(Cat)
Net-(RLD89-2): RLD89.2 RPR89.2(Cat)
Net-(RLD91-1): RLD91.1 RPR91.2(Cat)
Net-(RLD92-1): RLD92.1 RPR92.2(Cat)
Net-(RLD93-1): RLD93.1 RPR93.2(Cat)
Net-(RLD94-1): RLD94.1 RPR94.2(Cat)
Net-(RLD95-1): RLD95.1 RPR95.2(Cat)
Net-(RLD96-1): RLD96.1 RPR96.2(Cat)
Net-(RLD97-1): RLD97.1 RPR97.2(Cat)
Net-(RLD98-1): RLD98.1 RPR98.2(Cat)
Net-(RLD99-1): RLD99.1 RPR99.2(Cat)

Not connected (* = marked no-connect by the designer): H2 6; U1 12(NC)* 13(NC)* 33(NC)* 34(NC)*; U4 1(NC)*; USB1 2(Data-)* 3(Data+)* 4(ID)*
